# Altium project Capstone_SDR_PLUTOV2.PrjPcb (part 3 of 3)

## Sheet POWERMANAGE.SchDoc
size A3; SheetNumber: 10; SheetTotal: 14; SPICEModelCacheCHAYJENF: <root> / <DocumentId>CHAYJENF</DocumentId> / <CacheFrame Number="0"> / <Model Name="emk105bj105_v-f" Kind="CKT"> / <Text>* EMK105BJ105_V-F     SPICE MODEL  ( General Type ) / *-------------------------------------------------------------------------------------------------------- / * Model Generated by TAIYO YUDEN Corporation (http://www.ty-top.com) / * Version 1.0 / * TAIYO YUDEN Control No. 170508_130520 / * Copyright(c) 2012 TAIYO YUDEN CO.,LTD. All Rights Reserved. / *-------------------------------------------------------------------------------------------------------- / * / * Products Name : Multilayer Ceramic Capacitors / * / * Characteristics : / *     Capacitance : 1 uF , Rated Voltage : 16V , TCC : X5R / *     Case Size : 1.0 x 0.5 / 0.039 x 0.02 [mm/inch] , Thickness : 0.5 / 0.02 [mm/inch] / *     (Conditions: Temperature = 25 degC , DC Bias Current/Voltage = 0A / 0V) / * / * Frequency Range : 40Hz - 3GHz / * / * External Node Assignments : / * / *  1  o---| |---o  2 / * / *-------------------------------------------------------------------------------------------------------- / .SubCkt EMK105BJ105_V-F 1 2 / **************************** / C0 1 110 0.68309u / Cm 1 101 0.26053u / C1 101 102 0.94076u / Rc1 101 102 1.9029k / C2 102 103 0.66707u / Rc2 102 103 120.36 / C3 103 110 0.57203u / Rc3 103 110 2.1097 / C2m 1 301 0.1871u / C21 301 302 3.2494u / Rc21 301 302 1.1117k / C22 302 303 2.1014u / Rc22 302 303 1.484k / C23 303 304 2.1172u / Rc23 303 304 1.3876k / C24 304 305 0.75729u / Rc24 304 305 332.59 / C25 305 306 0.94401u / Rc25 305 306 249.09 / C26 306 307 0.34674u / Rc26 306 307 28.352 / C27 307 308 0.37158u / Rc27 307 308 19.989 / C28 308 309 0.17933u / Rc28 308 309 31.748 / C29 309 110 0.016445u / Rc29 309 110 1.0592 / Rp0 1 110 100Meg / L0 110 120 0.2216n / Lm 120 130 0.1509n / L1 120 121 0.12659n / RL1 121 130 0.85161 / L2 120 122 0.15996n / RL2 122 130 0.42469 / L3 120 123 7.9543n / RL3 123 130 0.54643m / CR 120 124 0.24334u / LR 124 125 0.090738n / RR 125 130 68.076m / CL 130 140 2.7354p / LL 130 140 0.10762n / RL 130 140 50.614 / Rs 140 2 7.5416m / **************************** / .ends EMK105BJ105_V-F</Text> / </Model> / </CacheFrame> / </root>
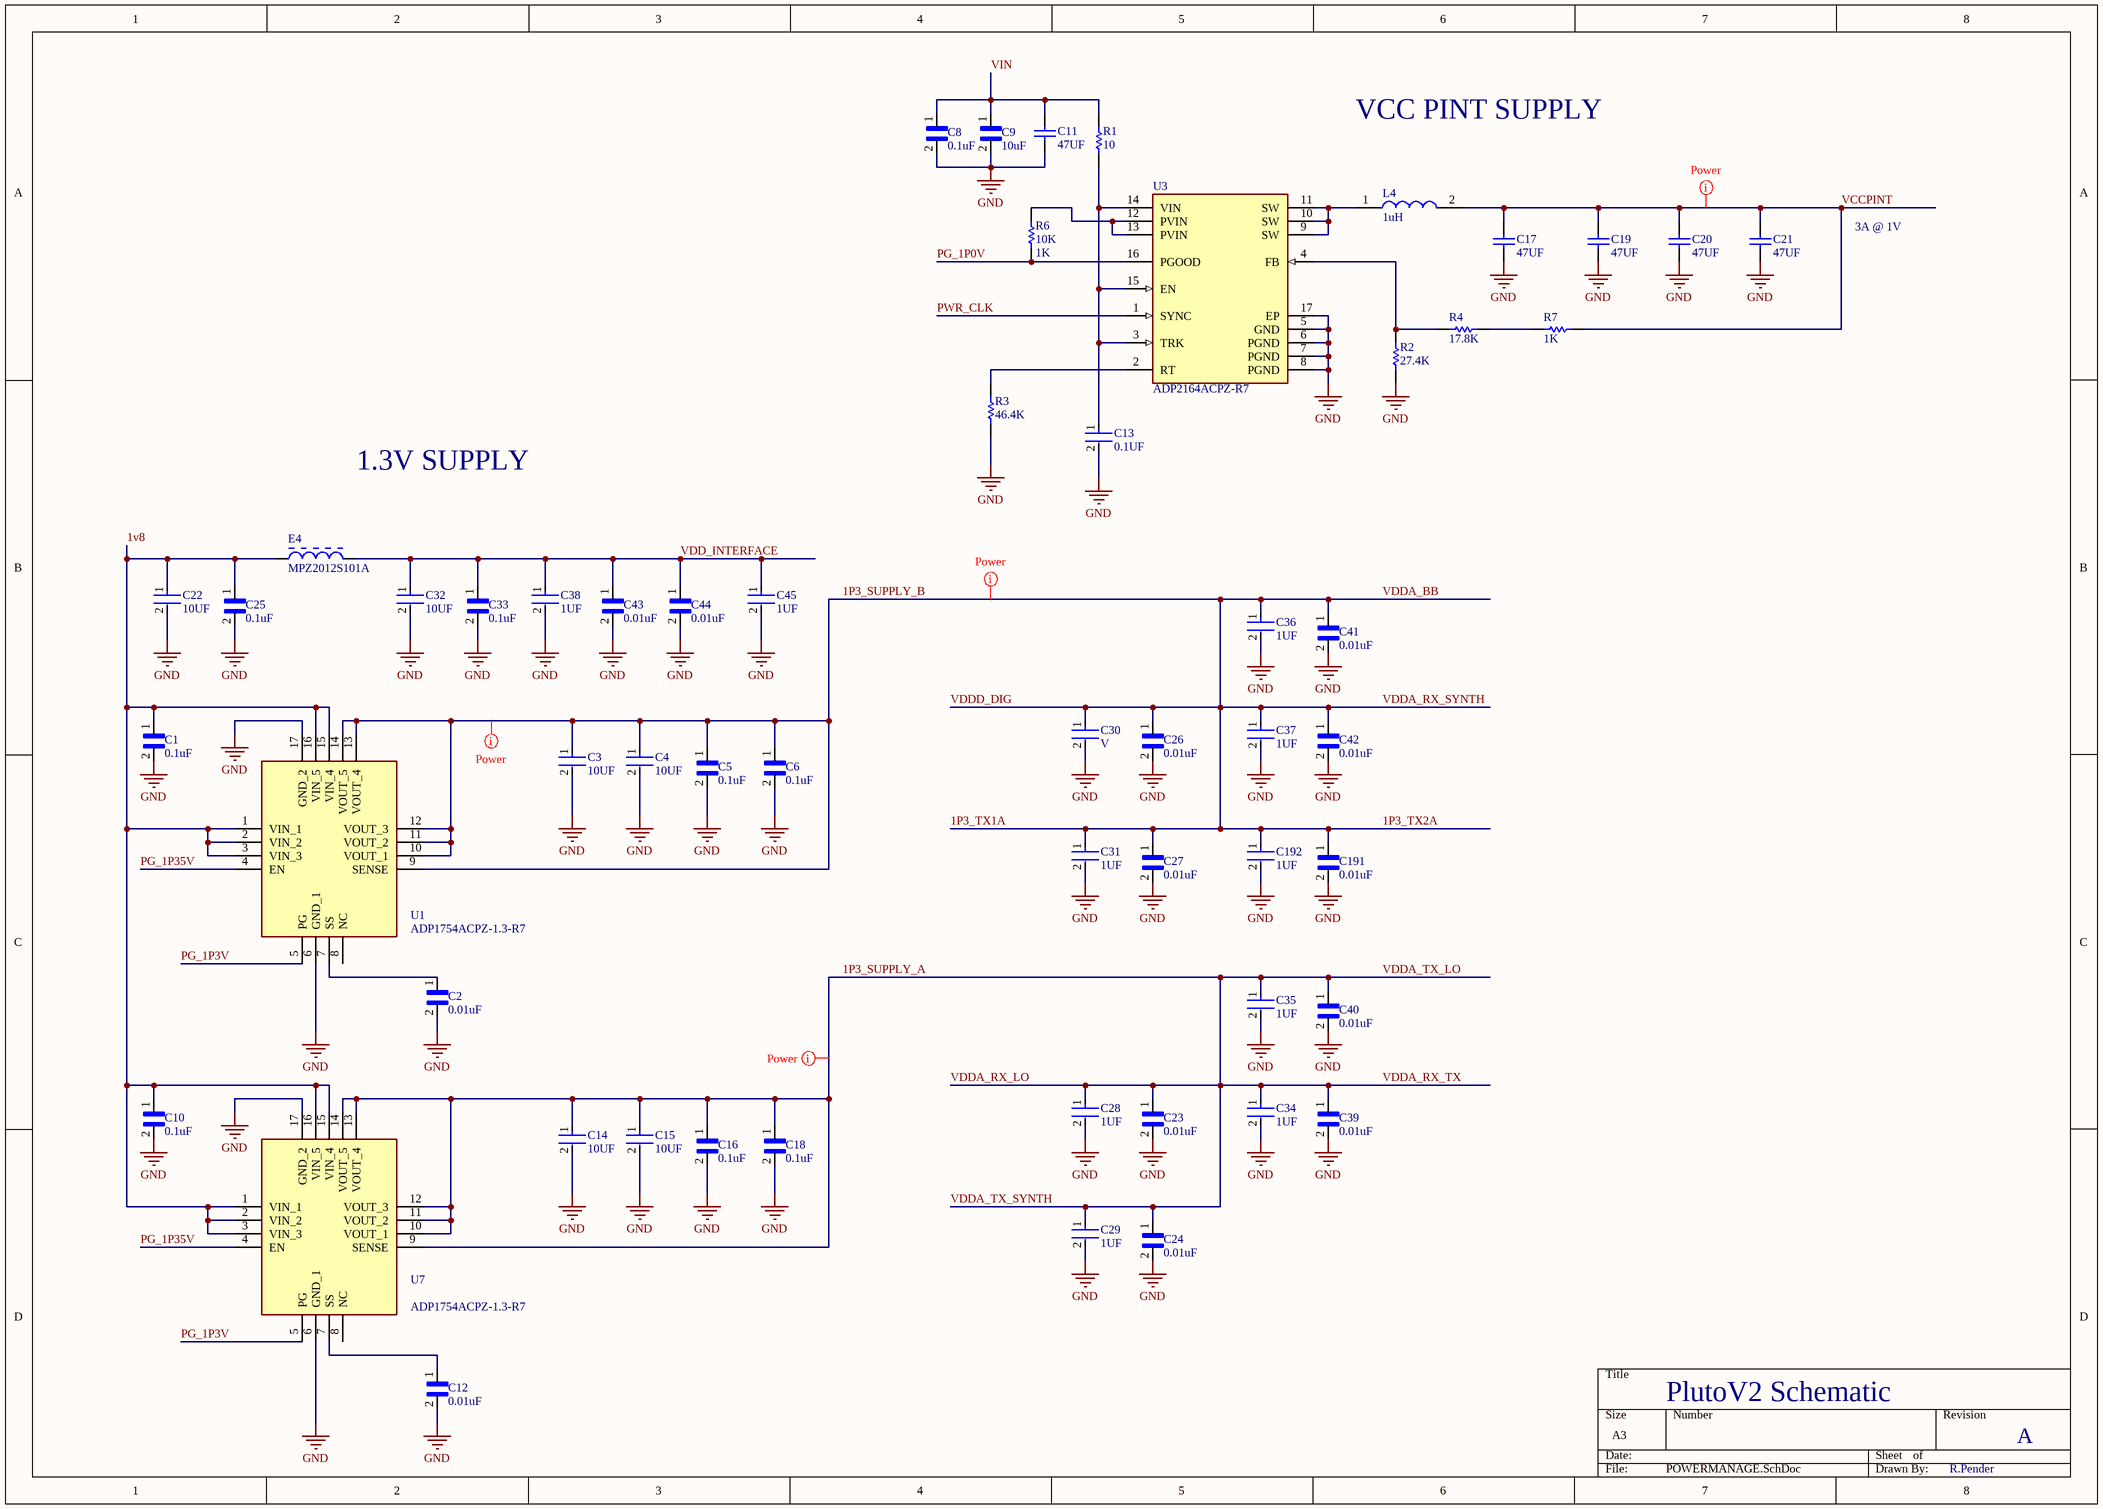
[diagram p9: POWERMANAGE.SchDoc]

### Parts
C1  0.1uF  [CAPC0603X33N]
C2  0.01uF  [CAPC0603X33N]
C3  10UF  [FP-GRM188-0_1-e0_2_0_55-IPC_A]
C4  10UF  [FP-GRM188-0_1-e0_2_0_55-IPC_A]
C5  0.1uF  [CAPC0603X33N]
C6  0.1uF  [CAPC0603X33N]
C8  0.1uF  [CAPC0603X33N]
C9  10uF  [CAPC0603X33N]
C10  0.1uF  [CAPC0603X33N]
C11  47UF  [TAYO-JMK212BBJ476MG-T_L]
C12  0.01uF  [CAPC0603X33N]
C13  0.1UF  [FP-GRM188-0_15-MFG]
C14  10UF  [FP-GRM188-0_1-e0_2_0_55-IPC_A]
C15  10UF  [FP-GRM188-0_1-e0_2_0_55-IPC_A]
C16  0.1uF  [CAPC0603X33N]
C17  47UF  [TAYO-JMK212BBJ476MG-T_L]
C18  0.1uF  [CAPC0603X33N]
C19  47UF  [TAYO-JMK212BBJ476MG-T_L]
C20  47UF  [TAYO-JMK212BBJ476MG-T_L]
C21  47UF  [TAYO-JMK212BBJ476MG-T_L]
C22  10UF  [FP-GRM188-0_1-e0_2_0_55-IPC_A]
C23  0.01uF  [CAPC0603X33N]
C24  0.01uF  [CAPC0603X33N]
C25  0.1uF  [CAPC0603X33N]
C26  0.01uF  [CAPC0603X33N]
C27  0.01uF  [CAPC0603X33N]
C28  1UF  [FP-0402-L_1_0_0_05-W_0_5-IPC_A]
C29  1UF  [FP-0402-L_1_0_0_05-W_0_5-IPC_A]
C30  V  [FP-0402-L_1_0_0_05-W_0_5-IPC_A]
C31  1UF  [FP-0402-L_1_0_0_05-W_0_5-IPC_A]
C32  10UF  [FP-GRM188-0_1-e0_2_0_55-IPC_A]
C33  0.1uF  [CAPC0603X33N]
C34  1UF  [FP-0402-L_1_0_0_05-W_0_5-IPC_A]
C35  1UF  [FP-0402-L_1_0_0_05-W_0_5-IPC_A]
C36  1UF  [FP-0402-L_1_0_0_05-W_0_5-IPC_A]
C37  1UF  [FP-0402-L_1_0_0_05-W_0_5-IPC_A]
C38  1UF  [FP-0402-L_1_0_0_05-W_0_5-IPC_A]
C39  0.01uF  [CAPC0603X33N]
C40  0.01uF  [CAPC0603X33N]
C41  0.01uF  [CAPC0603X33N]
C42  0.01uF  [CAPC0603X33N]
C43  0.01uF  [CAPC0603X33N]
C44  0.01uF  [CAPC0603X33N]
C45  1UF  [FP-0402-L_1_0_0_05-W_0_5-IPC_A]
C191  0.01uF  [CAPC0603X33N]
C192  1UF  [FP-0402-L_1_0_0_05-W_0_5-IPC_A]
E4  MPZ2012S101A  [TDK-MPZ2012S101A-2_V]
L4  1uH  [XFL4020102MEB]
R1  10  [RESC0603X26X15LL03T05]
R2  27.4K  [2-0402]
R3  46.4K  [1-0201]
R4  17.8K  [2-0402]
R6  10K  value 1K  [AXIAL-0.3]
R7  1K  [2-0402]
U1  ADP1754ACPZ-1.3-R7  [QFN65P400X400X80-17N-D]
U3  ADP2164ACPZ-R7  [FP-CP-16-26-IPC_C]
U7  ADP1754ACPZ-1.3-R7  [QFN65P400X400X80-17N-D]

### Nets
GND: C1.2 C2.2 C3.2 C4.2 C5.2 C6.2 C8.2 C9.2 C10.2 C11.2 C12.2 C13.2 C14.2 C15.2 C16.2 C17.2 C18.2 C19.2 C20.2 C21.2 C22.2 C23.2 C24.2 C25.2 C26.2 C27.2 C28.2 C29.2 C30.2 C31.2 C32.2 C33.2 C34.2 C35.2 C36.2 C37.2 C38.2 C39.2 C40.2 C41.2 C42.2 C43.2 C44.2 C45.2 C191.2 C192.2 R2.2 R3.2 U1.6(GND_1) U1.17(GND_2) U3.5(GND) U3.6(PGND) U3.7(PGND) U3.8(PGND) U3.17(EP) U7.6(GND_1) U7.17(GND_2)
1P3_SUPPLY_A: C14.1 C15.1 C16.1 C18.1 C23.1 C24.1 C28.1 C29.1 C34.1 C35.1 C39.1 C40.1 U7.9(SENSE) U7.10(VOUT_1) U7.11(VOUT_2) U7.12(VOUT_3) U7.13(VOUT_4) U7.14(VOUT_5)  [also labelled VDDA_RX_LO, VDDA_RX_TX, VDDA_TX_LO, VDDA_TX_SYNTH]
1P3_SUPPLY_B: C3.1 C4.1 C5.1 C6.1 C26.1 C27.1 C30.1 C31.1 C36.1 C37.1 C41.1 C42.1 C191.1 C192.1 U1.9(SENSE) U1.10(VOUT_1) U1.11(VOUT_2) U1.12(VOUT_3) U1.13(VOUT_4) U1.14(VOUT_5)  [also labelled 1P3_TX1A, 1P3_TX2A, VDDA_BB, VDDA_RX_SYNTH, VDDD_DIG]
1v8: C1.1 C10.1 C22.1 C25.1 E4.1 U1.1(VIN_1) U1.2(VIN_2) U1.3(VIN_3) U1.15(VIN_4) U1.16(VIN_5) U7.1(VIN_1) U7.2(VIN_2) U7.3(VIN_3) U7.15(VIN_4) U7.16(VIN_5)
PG_1P0V: R6.1 U3.16(PGOOD)
PG_1P3V: U1.5(PG) U7.5(PG)
PG_1P35V: U1.4(EN) U7.4(EN)
PWR_CLK: U3.1(SYNC)
VCCPINT: C17.1 C19.1 C20.1 C21.1 L4.2 R7.2
VDD_INTERFACE: C32.1 C33.1 C38.1 C43.1 C44.1 C45.1 E4.2
VIN: C8.1 C9.1 C11.1 R1.2
NetC2_1: C2.1 U1.7(SS)
NetC12_1: C12.1 U7.7(SS)
NetC13_1: C13.1 R1.1 U3.3(TRK) U3.14(VIN) U3.15(EN)
NetL4_1: L4.1 U3.9(SW) U3.10(SW) U3.11(SW)
NetR2_1: R2.1 R4.1 U3.4(FB)
NetR3_1: R3.1 U3.2(RT)
NetR4_2: R4.2 R7.1
NetR6_2: R6.2 U3.12(PVIN) U3.13(PVIN)

Not connected (* = marked no-connect by the designer): U1 8(NC); U7 8(NC)

### Layout directives
net class Power: 1P3_SUPPLY_A, 1P3_SUPPLY_B, VCCPINT

### Notes on the sheet
- VCC PINT SUPPLY
- 3A @ 1V
- 1.3V SUPPLY
- PlutoV2 Schematic
- A
- R.Pender

### Library data of the parts
C1 C5 C6 C8 C10 C16 C18 C25 C33 = GRM033R61C104ME84D: CAP 0.1UF 16VDC X5R 20% SMD 0201 PAPER TAPE; Package: None; Price: None; Value: *; MP: GRM033R61C104ME84D; Availability: Unavailable
C2 C9 C12 C23 C24 C26 C27 C39-C44 C191 = GRM033R71A103KA01D: SMD Capacitor X7R(EIA) with Capacitance: 10000pF Tol. 10%. Rated Voltage: 10Vdc; MF: Murata; Package: 0603 Taiyo Yuden; MP: GRM033R71A103KA01D; Value: *; SnapEDA_Link: https://www.snapeda.com/parts/GRM033R71A103KA01D/Murata/view-part/4379446/?ref=snap; Availability: Unavailable; Price: None; Check_prices: https://www.snapeda.com/parts/GRM033R71A103KA01D/Murata/view-part/4379446/?ref=eda
C3 C4 C14 C15 C22 C32 = CMP-2006-02792-2: Chip Multilayer Ceramic Capacitors for General Purpose, 0603, 10uF, X5R, 15%, 20%, 6.3V; Packaging: Tape and Reel; Voltage Rating (DC): 6.3V; Width: 0.031inch; Termination: SMD/SMT; Dielectric: X5R; Package Quantity: 4000; Voltage Rating: 6.3V; Capacitance: 10uF; Case/Package: 0603; Min Operating Temperature: -55°C; Voltage: 6.3V; Length: 1.6mm; Thickness: 0.035inch; Lead Free: Lead Free; Depth: 0.8mm; Case Code (Imperial): 0603; Max Operating Temperature: 85°C; Material: Ceramic; Height: 0.8mm; Tolerance: 20%; Mount: Surface Mount; REACH SVHC: No SVHC; Radiation Hardening: No; Case Code (Metric): 1608
C11 C17 C19-C21 = CMP-2000-06498-1: High Value Multilayer Ceramic Capacitor, 47 uF, +/-20%, 6.3 V, -55 to 85 degC, 2-Pin SMD (0805), RoHS, Tape and Reel; Manufacturer: Taiyo Yuden; PCN Part Number: X5R,X7RDielectrics23/Jan/2008; Kits: 587-1797-KIT-ND-KITCAPCERHICAP0603&0805S; Temperature Coefficient: X5R; Tolerance: ±20%; Online Catalog: MSeries; Other Names: 587-1779-1; Capacitance: 47µF; Voltage - Rated: 6.3V; Catalog Drawings: xMKSeries_0805_1.25; Operating Temperature: -55°C~85°C; Mounting Technology: SurfaceMount; Package Reference: 0805; Features: -; Lead Spacing: -; Lead Style: -; Family: CeramicCapacitors; Size / Dimension: 0.079"Lx0.049"W(2.00mmx1.25mm); Package Description: 2-Pin SMD, Body 2.2 x 1.45 mm; Mounting Type: SurfaceMount,MLCC; Package / Case: 0805(2012Metric); Series: M; Category: Capacitors; Packaging: CutTape(CT); Datasheet Version: 10/2015; Datasheet URL: http://datasheet.octopart.com/JMK212BJ476MG-T-Taiyo-Yuden-datasheet-62109412.pdf; Manufacturer URL: http://www.t-yuden.com/; Ratings: -; Height - Seated (Max): -; Standard Package: 1; Thickness (Max): 0.053"(1.35mm); Applications: GeneralPurpose
C13 = CMP-06035-003612-1: as C135-C138 on sheet POWERREG; Tolerance: 20%; Dielectric: X5R; Package Quantity: 4000; Width: 0.8mm; Case/Package: 0603; Thickness: 0.035inch; Capacitance: 10uF; Voltage Rating: 10V; Voltage Rating (DC): 10V; Termination: SMD/SMT; Length: 1.6mm; Lead Free: Lead Free; Mount: Surface Mount; Height: 0.8mm; Depth: 0.8mm; Packaging: Tape and Reel; Weight: 0.000222oz; Min Operating Temperature: -55°C; Case Code (Metric): 1608; Max Operating Temperature: 85°C; Case Code (Imperial): 0603; Material: Ceramic
C28 C29 C31 C34-C38 C45 C192 = CMP-14477-000104-2: as C141 on sheet POWERREG; Packaging: Tape and Reel; Depth: 0.5mm; Mount: Surface Mount; Thickness: 0.022inch; Package Quantity: 1; Min Operating Temperature: -55°C; Series: M; Voltage Rating (DC): 16V; Termination: SMD/SMT; Case/Package: 0402; Number of Pins: 2; Case Code (Imperial): 0402; Capacitance: 1uF; Length: 1mm; Halogen Free: Halogen Free; Case Code (Metric): 1005; Width: 0.02inch; RoHS Compliant: Yes; Radiation Hardening: No; Max Operating Temperature: 85°C; Height: 0.5mm; Construction: Flat
C30 = CMP-14477-000104-2: None; Tolerance: 10%; Voltage Rating: 16V; Dielectric: X5R; Capacitance: 1uF; Packaging: Tape and Reel; Depth: 0.5mm; Mount: Surface Mount; Thickness: 0.022inch; Package Quantity: 1; Min Operating Temperature: -55°C; Series: M; Voltage Rating (DC): 16V; Termination: SMD/SMT; Case/Package: 0402; Number of Pins: 2; Case Code (Imperial): 0402; Length: 1mm; Halogen Free: Halogen Free; Case Code (Metric): 1005; Width: 0.02inch; RoHS Compliant: Yes; Radiation Hardening: No; Max Operating Temperature: 85°C; Height: 0.5mm; Construction: Flat
E4 = CMP-2000-05399-1: Chip Bead for Power Line, 100 Ohm, +/- 25%, 4 A, -55 to 125 degC, 0805 (2012 Metric), RoHS, Tape and Reel; Manufacturer: TDK; Maximum DC Resistance: 20mOhms; Test Frequency: 100MHz; Impedance: 100Ohms; Case Width: 1.25mm; Case Length: 2mm; Maximum DC Current: 4A; Case Height: 0.85mm; Package Reference: MPZ2012S101A-2; RoHS: Details; Tolerance: 25%; Operating Temperature Range: -55Cto+125C; Datasheet Version: Jul-13; Dimensions: 1.25mmWx2mmLx0.85mmH; Product: FerriteChipBeads; Termination Style: SMD/SMT; Datasheet URL: http://www.farnell.com/datasheets/1750041.pdf; Factory Pack Quantity: 4000; Brand: TDK; Packaging: Reel; Package Description: 2-Pin Surface Mount Device, Body 2 x 1.25 mm; Product Category: EMIFilterBeads,Chips&Arrays; Manufacturer URL: http://www.tdk.com/; Package / Case: 0805(2012metric)
L4 = XFL4020-102MEB: Inductor; Manufacturer_Name: COILCRAFT; Datasheet Link: https://www.coilcraft.com/getmedia/50632d43-da1b-4cdb-8ab4-3029cab51df3/xfl4020.pdf; Height: 2.1mm; Manufacturer_Part_Number: XFL4020-102MEB
R1 = CMP-2004-03448-1: Manufacturer: Panasonic; Part Number: ERJ1GNF10R0C
R2 R4 R7 = ERJ2RK: Precision Thick Film Chip Resistor, 10 Ohm to 1M Ohm Range, 1% and 0.5% Tolerance, 0402 Size, 0.063 W; Published: 17-Dec-2003; LatestRevisionDate: 19-Mar-2004; LatestRevisionNote: Silkscreen size reduced.; PackageDocument: Mar-2003; PackageReference: 2-0402; Publisher: Altium Limited; Code_IPC: 1005 [0402]; ComponentLink1Description: Manufacturer Link; ComponentLink1URL: http://www.panasonic.com/industrial/components/resistive_products.htm; ComponentLink2Description: Datasheet; ComponentLink2URL: http://www.panasonic.com/industrial/components/pdf/AOA0000CE2.pdf
R3 = ERJ1GE: Thick Film Chip Resistor, 10 Ohm to 1M Ohm Range, 5% Tolerance, 0201 Size, 0.05 W; Note: If flow soldering, adjust pad width of PCB Footprint to 0.7 - 0.8 times the width of the resistor.; Published: 17-Dec-2003; LatestRevisionDate: 19-Mar-2004; LatestRevisionNote: Silkscreen size reduced.; PackageDocument: Mar-2003; PackageReference: 1-0201; Publisher: Altium Limited; ComponentLink1Description: Manufacturer Link; ComponentLink1URL: http://www.panasonic.com/industrial/components/resistive_products.htm; ComponentLink2Description: Datasheet; ComponentLink2URL: http://www.panasonic.com/industrial/components/pdf/AOA0000CE1.pdf
R6 = Res1: Resistor; Published: 8-Jun-2000; LatestRevisionDate: 17-Jul-2002; LatestRevisionNote: Re-released for DXP Platform.; PackageReference: AXIAL-0.3; Publisher: Altium Limited; PackageDescription: Axial Device, Thru-Hole; 2 Leads; 0.3 in Pin Spacing
U1 U7 = ADP1754ACPZ-1.3-R7: Integrated Circuit; Manufacturer_Name: Analog Devices; Datasheet Link: https://www.analog.com/media/en/technical-documentation/data-sheets/ADP1754_1755.pdf; Height: 0.8mm; Manufacturer_Part_Number: ADP1754ACPZ-1.3-R7
U3 = CMP-09139-000017-1: IC REG BUCK ADJ 4A 16LFCSP; Manufacturer: Analog Devices; Standoff Height: 0.02mm; Max Junction Temp: +125°C; Max Duty Cycle: 100%; Output Type: AdjustableProgrammable; Switching Frequency: 500-1400kHz; Min Supply Voltage: 2.7V; Max Supply Voltage: 6.5V; Nominal Supply Current: 895uA; Number Of Outputs: 1; Output Voltage: 0.6-6.5V; Switching Topology: Buck; Mouser Description: Dc-Dc Switching Buck Step Down Regulator, Adjustable, 2.7V-6.5Vin, 600Mv-6.5Vout, 4Aout, Lfcsp-16 Rohs Compliant: Yes; Automotive: No; Height: 0.8mm; Temperature Range Low: -40°C; ComponentLink2Description: Datasheet; Octopart: https://octopart.com/adp2164acpz-r7-analog+devices-21054168; Lead Free: Yes; ComponentLink2URL: https://www.analog.com/media/en/technical-documentation/data-sheets/ADP2164.PDF; Category: IC; Output Current: 4A; RoHS: TRUE; Ipc Land Pattern Name: QFN65P400X400X75-16; Device Class L2: Power Management ICs; Package: CP-16-26; Temperature Range High: +125°C; Device Class L1: Integrated Circuits (ICs); Manufacturer Part Number: ADP2164ACPZ-R7; Digikey Description: IC REG BUCK ADJ 4A 16LFCSP; Device Class L3: Voltage Regulators - Switching; Temperature: -40°C to +125°C

## Sheet POWERMANAGE2.SchDoc
size A3; SheetNumber: 11; SheetTotal: 14; SPICEModelCacheVRZJBZTH: <root> / <DocumentId>VRZJBZTH</DocumentId> / </root>
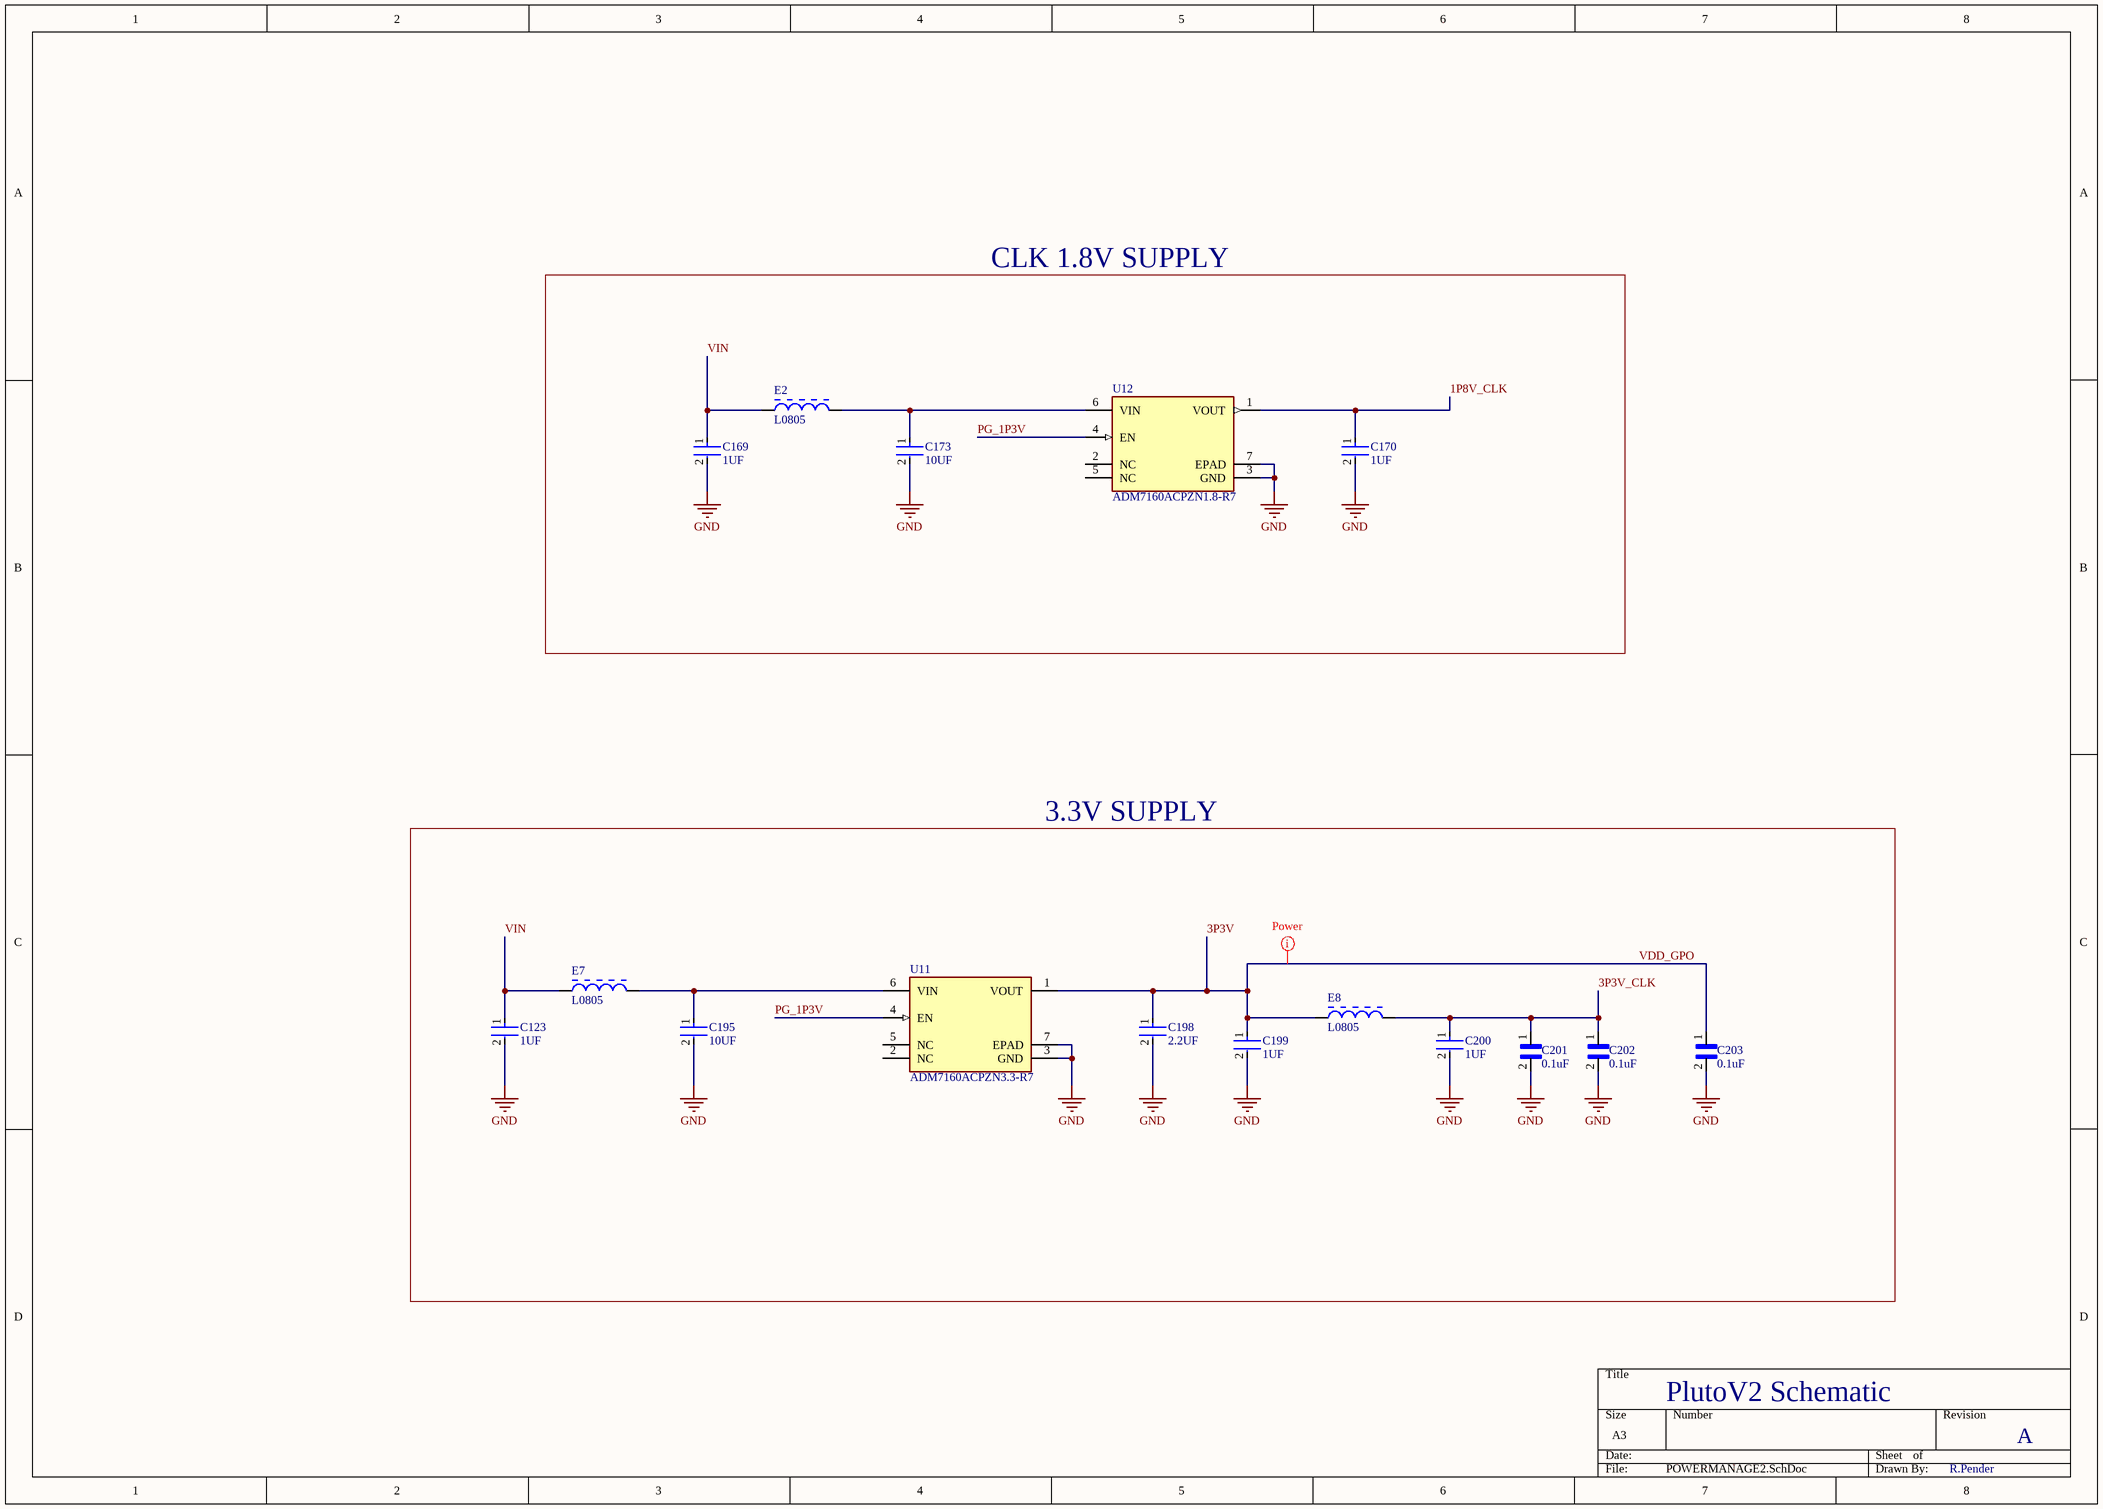
[diagram p10: POWERMANAGE2.SchDoc]

### Parts
C123  1UF  [FP-0402-L_1_0_0_05-W_0_5-IPC_A]
C169  1UF  [FP-0402-L_1_0_0_05-W_0_5-IPC_A]
C170  1UF  [FP-0402-L_1_0_0_05-W_0_5-IPC_A]
C173  10UF  [FP-GRM188-0_15-MFG]
C195  10UF  [FP-GRM188-0_15-MFG]
C198  2.2UF  [FP-GRM188-0_2-IPC_C]
C199  1UF  [FP-0402-L_1_0_0_05-W_0_5-IPC_A]
C200  1UF  [FP-0402-L_1_0_0_05-W_0_5-IPC_A]
C201  0.1uF  [CAPC0603X33N]
C202  0.1uF  [CAPC0603X33N]
C203  0.1uF  [CAPC0603X33N]
E2  L0805  [TDK-MPZ2012S101A-2_V]
E7  L0805  [TDK-MPZ2012S101A-2_V]
E8  L0805  [TDK-MPZ2012S101A-2_V]
U11  ADM7160ACPZN3.3-R7  [FP-CP-6-3-IPC_A]
U12  ADM7160ACPZN1.8-R7  [FP-CP-6-3-IPC_C]

### Blocks framed on the sheet
CLK 1.8V SUPPLY: C169 C170 C173 E2 U12
3.3V SUPPLY: C123 C195 C198-C203 E7 E8 U11

### Nets
GND: C123.2 C169.2 C170.2 C173.2 C195.2 C198.2 C199.2 C200.2 C201.2 C202.2 C203.2 U11.3(GND) U11.7(EPAD) U12.3(GND) U12.7(EPAD)
1P8V_CLK: C170.1 U12.1(VOUT)
3P3V: C198.1 C199.1 C203.1 E8.1 U11.1(VOUT)  [also labelled VDD_GPO]
3P3V_CLK: C200.1 C201.1 C202.1 E8.2
PG_1P3V: U11.4(EN) U12.4(EN)
VIN: C123.1 C169.1 E2.1 E7.1
NetC173_1: C173.1 E2.2 U12.6(VIN)
NetC195_1: C195.1 E7.2 U11.6(VIN)

Not connected (* = marked no-connect by the designer): U11 2(NC) 5(NC); U12 2(NC) 5(NC)

### Layout directives
net class Power: 3P3V

### Notes on the sheet
- PlutoV2 Schematic
- A
- R.Pender

### Library data of the parts
C123 C169 C170 C199 C200 = CMP-14477-000104-2: as C141 on sheet POWERREG; Packaging: Tape and Reel; Depth: 0.5mm; Mount: Surface Mount; Thickness: 0.022inch; Package Quantity: 1; Min Operating Temperature: -55°C; Series: M; Voltage Rating (DC): 16V; Termination: SMD/SMT; Case/Package: 0402; Number of Pins: 2; Case Code (Imperial): 0402; Capacitance: 1uF; Length: 1mm; Halogen Free: Halogen Free; Case Code (Metric): 1005; Width: 0.02inch; RoHS Compliant: Yes; Radiation Hardening: No; Max Operating Temperature: 85°C; Height: 0.5mm; Construction: Flat
C173 C195 = CMP-06035-003612-1: as C135-C138 on sheet POWERREG; Tolerance: 20%; Dielectric: X5R; Package Quantity: 4000; Width: 0.8mm; Case/Package: 0603; Thickness: 0.035inch; Capacitance: 10uF; Voltage Rating: 10V; Voltage Rating (DC): 10V; Termination: SMD/SMT; Length: 1.6mm; Lead Free: Lead Free; Mount: Surface Mount; Height: 0.8mm; Depth: 0.8mm; Packaging: Tape and Reel; Weight: 0.000222oz; Min Operating Temperature: -55°C; Case Code (Metric): 1608; Max Operating Temperature: 85°C; Case Code (Imperial): 0603; Material: Ceramic
C198 = CMP-06035-023692-1: Chip Multilayer Ceramic Capacitors for General Purpose, 0603, 2.2uF, X5R, 15%, 10%, 50V; Mount: Surface Mount; Case/Package: 0603; Voltage Rating (DC): 50V; Weight: 0.000222oz; Capacitance: 2.2uF; Max Operating Temperature: 85°C; Length: 0.063inch; Thickness: 0.039inch; Dielectric: X5R; Min Operating Temperature: -55°C; Termination: SMD/SMT; Resistor Type: Ceramic; Width: 0.8mm; Voltage Rating: 50V; Height: 0.8mm; Tolerance: 10%; Case Code (Metric): 1608; Package Quantity: 10000; Packaging: Tape and Reel; Case Code (Imperial): 0603
C201-C203 = GRM033R61C104ME84D: as C1 on sheet POWERMANAGE; Package: None; Price: None; Value: *; MP: GRM033R61C104ME84D; Availability: Unavailable
E2 E7 E8 = CMP-2000-05399-1: as E4 on sheet POWERMANAGE; Package Reference: MPZ2012S101A-2; RoHS: Details; Tolerance: 25%; Operating Temperature Range: -55Cto+125C; Datasheet Version: Jul-13; Dimensions: 1.25mmWx2mmLx0.85mmH; Product: FerriteChipBeads; Termination Style: SMD/SMT; Datasheet URL: http://www.farnell.com/datasheets/1750041.pdf; Factory Pack Quantity: 4000; Brand: TDK; Packaging: Reel; Package Description: 2-Pin Surface Mount Device, Body 2 x 1.25 mm; Product Category: EMIFilterBeads,Chips&Arrays; Manufacturer URL: http://www.tdk.com/; Package / Case: 0805(2012metric)
U11 = CMP-09138-000129-1: IC REG LINEAR 3.3V 200MA 6LFCSP; Output Type: Fixed; Max Supply Current: 265uA; Max Input Voltage: 5.5V; Number of Regulators: 1; Power Supply Rejection Ratio (PSRR): 49dB; Operating Supply Current: 265mA; Polarity: Positive; Min Input Voltage: 2.2V; Dropout Voltage: 150mV; Accuracy: 1%; Min Current Limit: 220mA; Max Output Current: 200mA; RoHS Compliant: Yes; Case/Package: TSOT; Max Operating Temperature: 125°C; Contact Plating: Gold; Number of Pins: 6; Mount: Surface Mount; Packaging: Tape and Reel; Number of Outputs: 1; Lead Free: Contains Lead; Package Quantity: 3000; Min Operating Temperature: -40°C; Output Voltage: 3.3V; Output Current: 200mA; Quiescent Current: 265uA
U12 = CMP-09138-000112-1: IC REG LINEAR 1.8V 200MA 6LFCSP; Operating Supply Current: 265mA; Power Supply Rejection Ratio (PSRR): 49dB; Polarity: Positive; Max Supply Current: 265uA; Dropout Voltage: 230mV; Number of Outputs: 1; Min Current Limit: 220mA; Output Type: Fixed; Accuracy: 1%; Min Input Voltage: 2.2V; Max Input Voltage: 5.5V; Packaging: Tape and Reel; Case/Package: TSOT; Contact Plating: Gold; Mount: Surface Mount; Max Output Current: 200mA; Min Operating Temperature: -40°C; Output Voltage: 1.8V; Output Current: 200mA; Number of Pins: 6; Package Quantity: 3000; Lead Free: Contains Lead; Quiescent Current: 265uA; Max Operating Temperature: 125°C; Number of Regulators: 1; RoHS Compliant: Yes

## Sheet TESTPOINTS.SchDoc
size A3; SheetNumber: 12; SheetTotal: 14
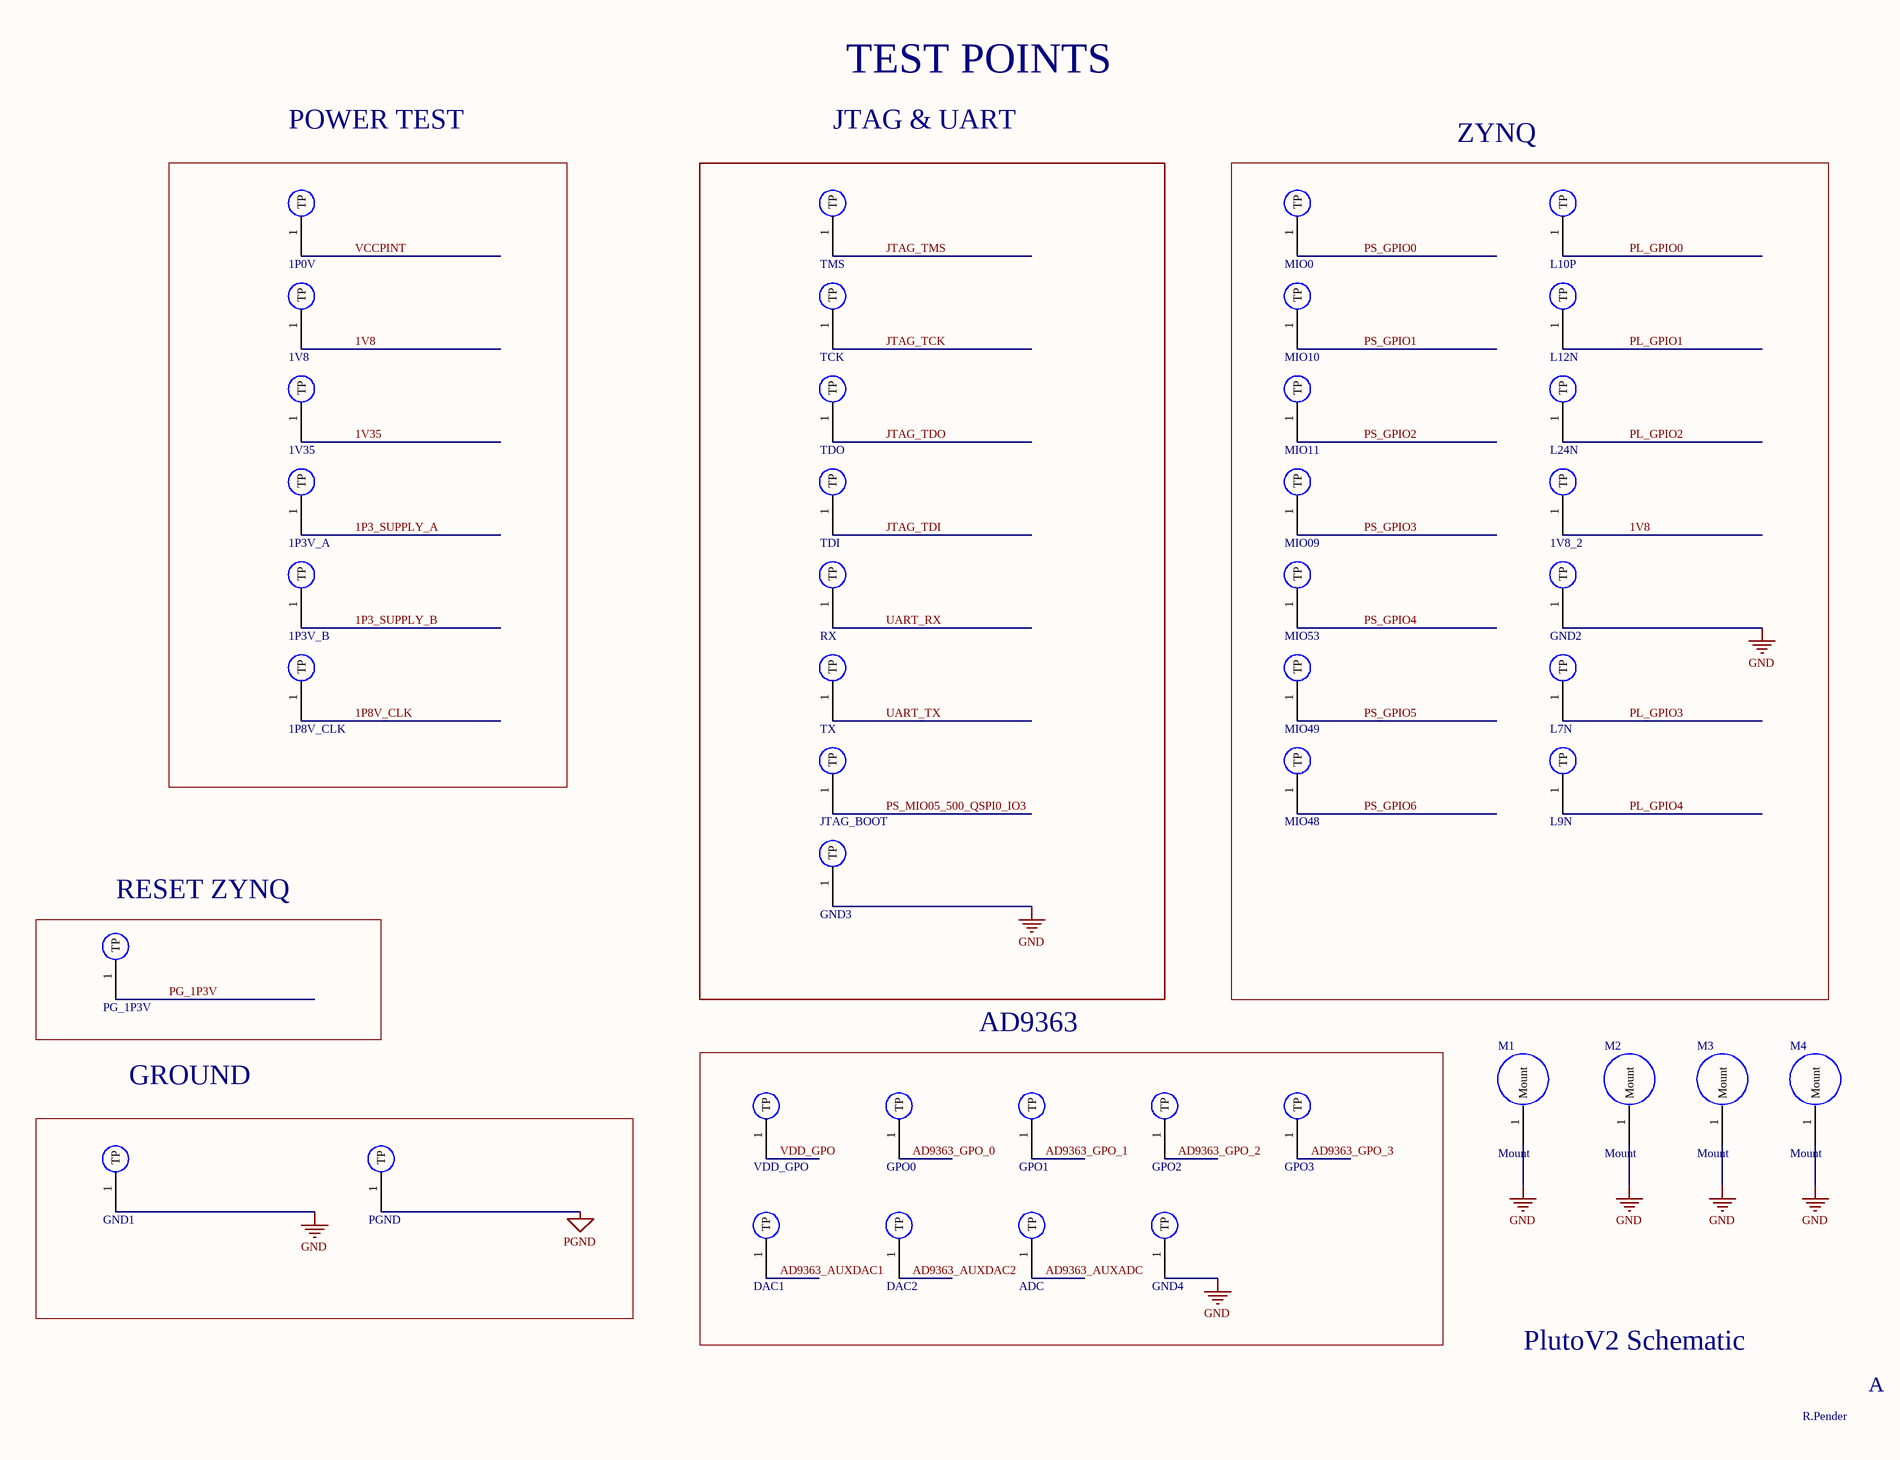
[diagram p11: TESTPOINTS.SchDoc, left]
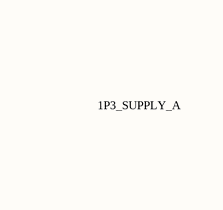
[diagram p12: TESTPOINTS.SchDoc, right]

### Parts
1P0V  TEST POINT  [TESTPOINT1]  (value not drawn)  (no BOM)
1P3V_A  TEST POINT  [TESTPOINT1]  (value not drawn)  (no BOM)
1P3V_B  TEST POINT  [TESTPOINT1]  (value not drawn)  (no BOM)
1P8V_CLK  TEST POINT  [TESTPOINT1]  (value not drawn)  (no BOM)
1V8  TEST POINT  [TESTPOINT1]  (value not drawn)  (no BOM)
1V8_2  TEST POINT  [TESTPOINT1]  (value not drawn)  (no BOM)
1V35  TEST POINT  [TESTPOINT1]  (value not drawn)  (no BOM)
ADC  TEST POINT  [TESTPOINT1]  (value not drawn)  (no BOM)
DAC1  TEST POINT  [TESTPOINT1]  (value not drawn)  (no BOM)
DAC2  TEST POINT  [TESTPOINT1]  (value not drawn)  (no BOM)
GND1  TEST POINT  [TESTPOINT1]  (value not drawn)  (no BOM)
GND2  TEST POINT  [TESTPOINT1]  (value not drawn)  (no BOM)
GND3  TEST POINT  [TESTPOINT1]  (value not drawn)  (no BOM)
GND4  TEST POINT  [TESTPOINT1]  (value not drawn)  (no BOM)
GPO0  TEST POINT  [TESTPOINT1]  (value not drawn)  (no BOM)
GPO1  TEST POINT  [TESTPOINT1]  (value not drawn)  (no BOM)
GPO2  TEST POINT  [TESTPOINT1]  (value not drawn)  (no BOM)
GPO3  TEST POINT  [TESTPOINT1]  (value not drawn)  (no BOM)
JTAG_BOOT  TEST POINT  [TESTPOINT1]  (value not drawn)  (no BOM)
L7N  TEST POINT  [TESTPOINT1]  (value not drawn)  (no BOM)
L9N  TEST POINT  [TESTPOINT1]  (value not drawn)  (no BOM)
L10P  TEST POINT  [TESTPOINT1]  (value not drawn)  (no BOM)
L12N  TEST POINT  [TESTPOINT1]  (value not drawn)  (no BOM)
L24N  TEST POINT  [TESTPOINT1]  (value not drawn)  (no BOM)
M1  Mount  [Mount]
M2  Mount  [Mount]
M3  Mount  [Mount]
M4  Mount  [Mount]
MIO0  TEST POINT  [TESTPOINT1]  (value not drawn)  (no BOM)
MIO09  TEST POINT  [TESTPOINT1]  (value not drawn)  (no BOM)
MIO10  TEST POINT  [TESTPOINT1]  (value not drawn)  (no BOM)
MIO11  TEST POINT  [TESTPOINT1]  (value not drawn)  (no BOM)
MIO48  TEST POINT  [TESTPOINT1]  (value not drawn)  (no BOM)
MIO49  TEST POINT  [TESTPOINT1]  (value not drawn)  (no BOM)
MIO53  TEST POINT  [TESTPOINT1]  (value not drawn)  (no BOM)
PG_1P3V  TEST POINT  [TESTPOINT1]  (value not drawn)  (no BOM)
PGND  TEST POINT  [TESTPOINT1]  (value not drawn)  (no BOM)
RX  TEST POINT  [TESTPOINT1]  (value not drawn)  (no BOM)
TCK  TEST POINT  [TESTPOINT1]  (value not drawn)  (no BOM)
TDI  TEST POINT  [TESTPOINT1]  (value not drawn)  (no BOM)
TDO  TEST POINT  [TESTPOINT1]  (value not drawn)  (no BOM)
TMS  TEST POINT  [TESTPOINT1]  (value not drawn)  (no BOM)
TX  TEST POINT  [TESTPOINT1]  (value not drawn)  (no BOM)
VDD_GPO  TEST POINT  [TESTPOINT1]  (value not drawn)  (no BOM)

### Blocks framed on the sheet
ZYNQ: 1V8_2 GND2 L7N L9N L10P L12N L24N MIO0 MIO09-MIO11 MIO48 MIO49 MIO53
RESET ZYNQ: PG_1P3V
AD9363: ADC DAC1 DAC2 GND4 GPO0-GPO3 VDD_GPO

### Nets
GND: GND1.1(TP) GND2.1(TP) GND3.1(TP) GND4.1(TP) M1.1(Mount) M2.1(Mount) M3.1(Mount) M4.1(Mount)
PGND: PGND.1(TP)
1P3_SUPPLY_A: 1P3V_A.1(TP)
1P3_SUPPLY_B: 1P3V_B.1(TP)
1P8V_CLK: 1P8V_CLK.1(TP)
1v8: 1V8.1(TP) 1V8_2.1(TP)
1v35: 1V35.1(TP)
AD9363_AUXADC: ADC.1(TP)
AD9363_AUXDAC1: DAC1.1(TP)
AD9363_AUXDAC2: DAC2.1(TP)
AD9363_GPO_0: GPO0.1(TP)
AD9363_GPO_1: GPO1.1(TP)
AD9363_GPO_2: GPO2.1(TP)
AD9363_GPO_3: GPO3.1(TP)
JTAG_TCK: TCK.1(TP)
JTAG_TDI: TDI.1(TP)
JTAG_TDO: TDO.1(TP)
JTAG_TMS: TMS.1(TP)
PG_1P3V: PG_1P3V.1(TP)
PL_GPIO0: L10P.1(TP)
PL_GPIO1: L12N.1(TP)
PL_GPIO2: L24N.1(TP)
PL_GPIO3: L7N.1(TP)
PL_GPIO4: L9N.1(TP)
PS_GPIO0: MIO0.1(TP)
PS_GPIO1: MIO10.1(TP)
PS_GPIO2: MIO11.1(TP)
PS_GPIO3: MIO09.1(TP)
PS_GPIO4: MIO53.1(TP)
PS_GPIO5: MIO49.1(TP)
PS_GPIO6: MIO48.1(TP)
PS_MIO05_500_QSPI0_IO3: JTAG_BOOT.1(TP)
UART_RX: RX.1(TP)
UART_TX: TX.1(TP)
VCCPINT: 1P0V.1(TP)
VDD_GPO: VDD_GPO.1(TP)  [project net 3P3V]

### Notes on the sheet
- TEST POINTS
- POWER TEST
- JTAG & UART
- 1P3_SUPPLY_A
- GROUND
- PlutoV2 Schematic
- A
- R.Pender

### Library data of the parts
1P0V 1P3V_A 1P3V_B 1P8V_CLK 1V8 1V8_2 1V35 ADC DAC1 DAC2 GND1-GND4 GPO0-GPO3 JTAG_BOOT L7N L9N L10P L12N L24N MIO0 MIO09-MIO11 MIO48 MIO49 MIO53 PG_1P3V PGND RX TCK TDI TDO TMS TX VDD_GPO = TESTPT

## Sheet AD9363 OSCILLATORS.SchDoc
size A3; SheetNumber: 13; SheetTotal: 14
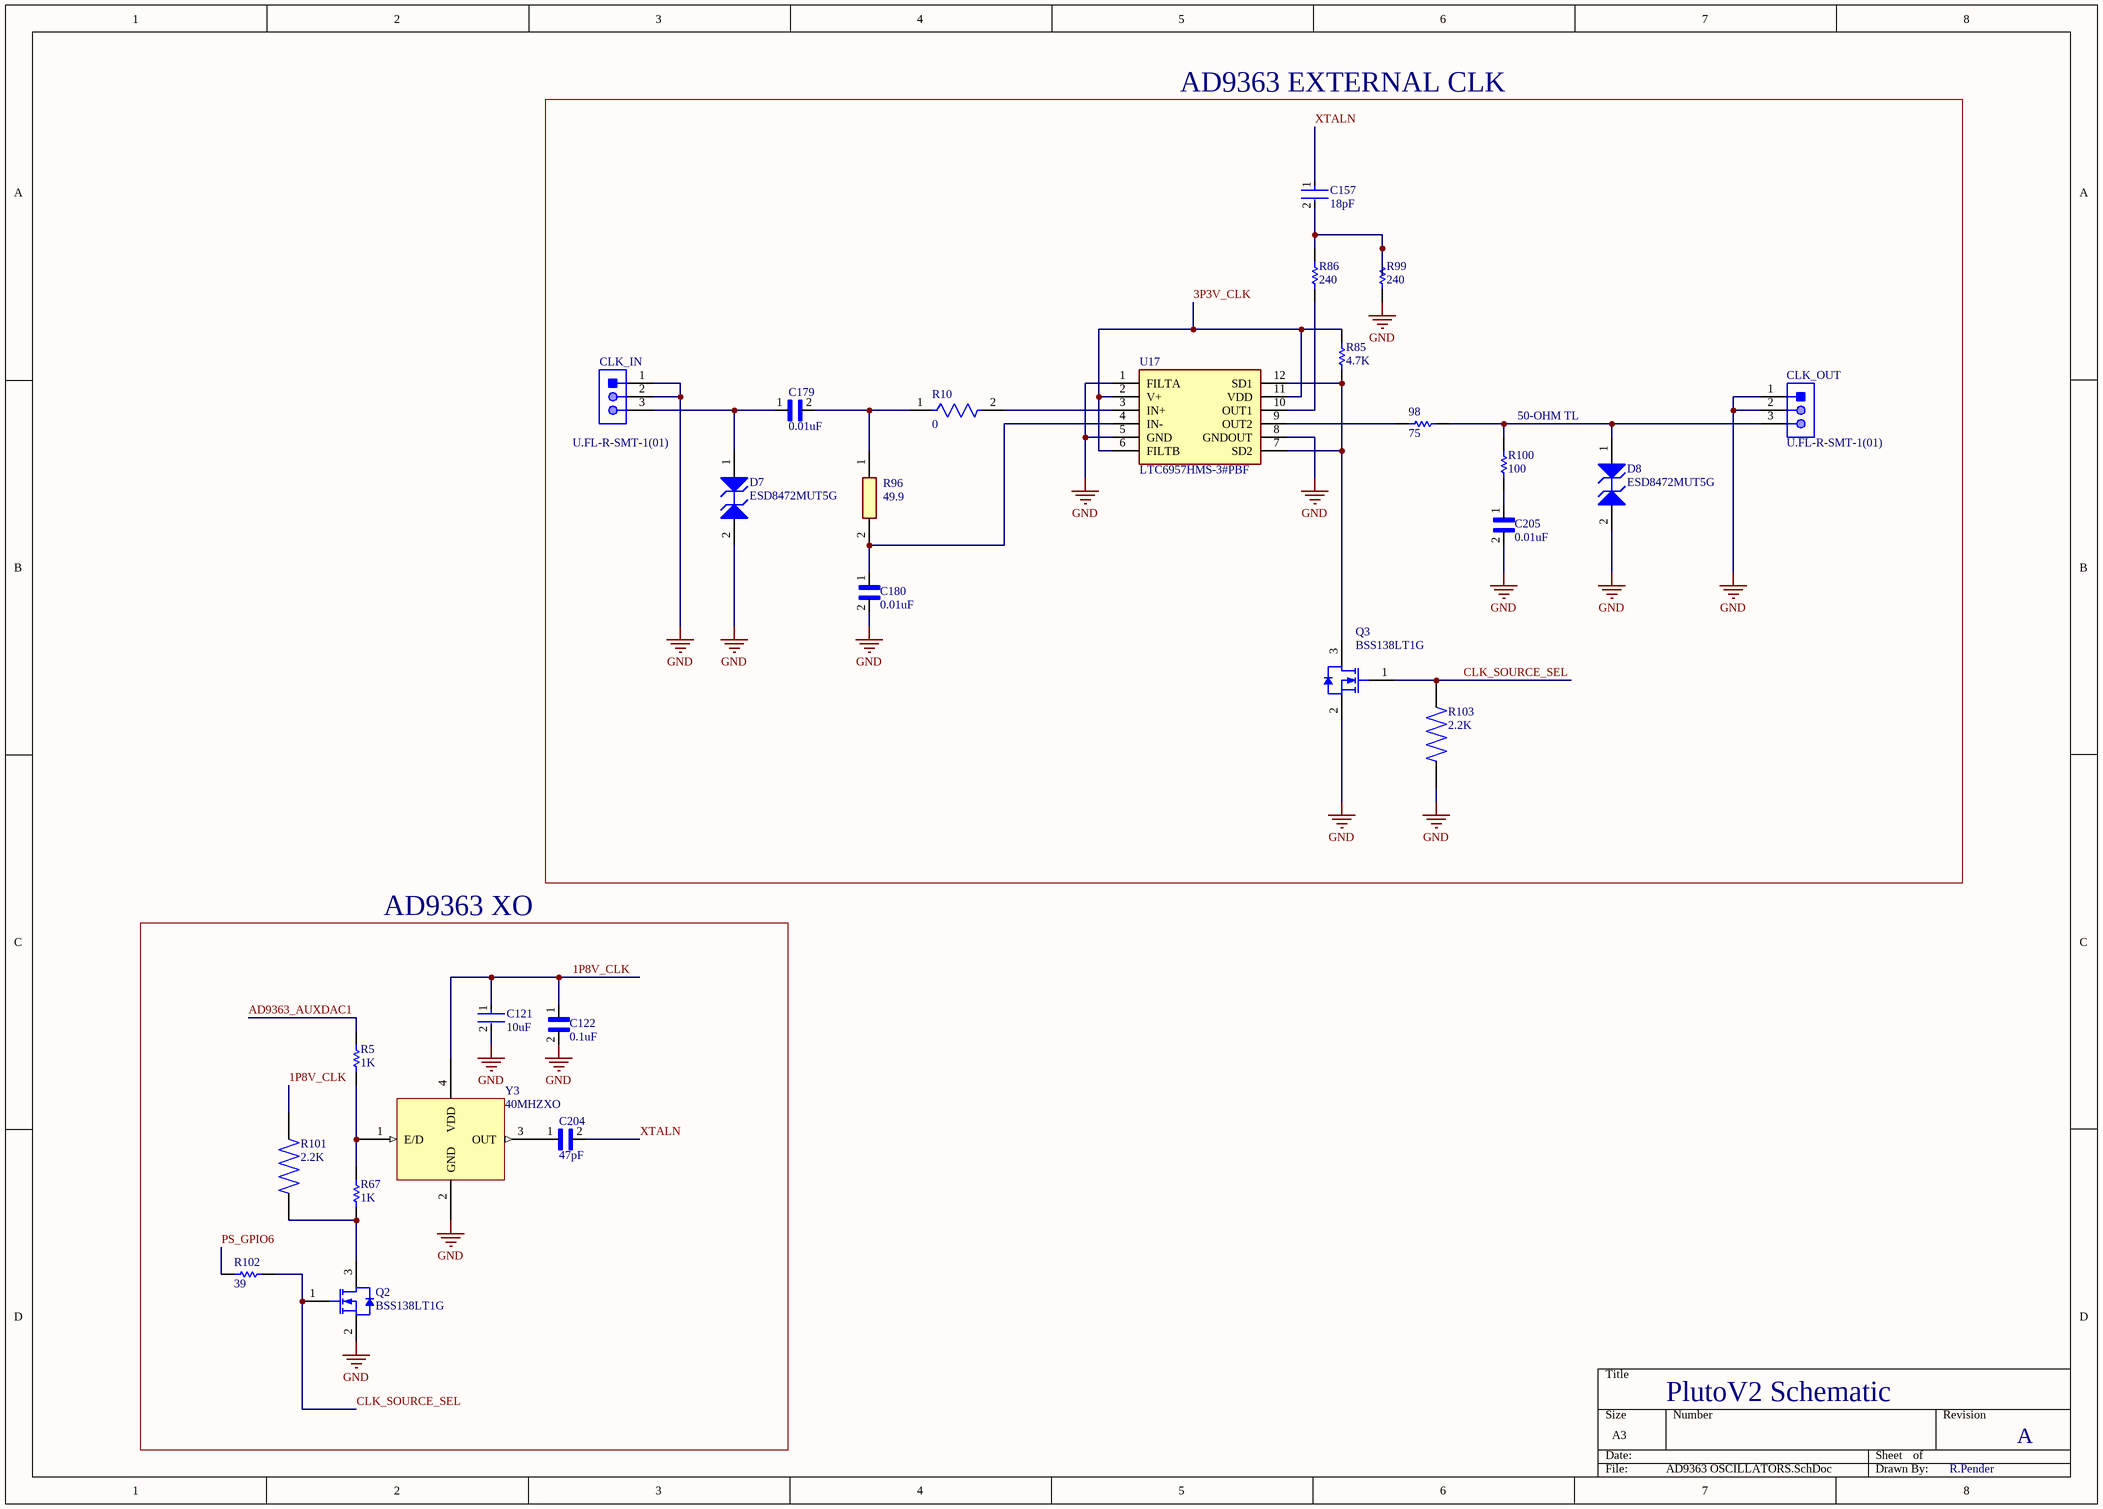
[diagram p13: AD9363 OSCILLATORS.SchDoc]

### Parts
98  75  [2-0402]
C121  10uF  [FP-GRM188-0_1-e0_2_0_55-IPC_C]
C122  0.1uF  [CAPC0603X33N]
C157  18pF  [FP-GRM033-0_03-IPC_A]
C179  0.01uF  [CAPC0603X33N]
C180  0.01uF  [CAPC0603X33N]
C204  47pF  [CAPC1005X55N]
C205  0.01uF  [CAPC0603X33N]
CLK_IN  U.FL-R-SMT-1(01)  [HRS-U.FL-R-SMT-3_V]
CLK_OUT  U.FL-R-SMT-1(01)  [HRS-U.FL-R-SMT-3_V]
D7  ESD8472MUT5G  [ONSC-X3DFN-2-152AF-01_V]
D8  ESD8472MUT5G  [ONSC-X3DFN-2-152AF-01_V]
Q2  BSS138LT1G  [ONSC-SOT-23-3-318-08_V]
Q3  BSS138LT1G  [ONSC-SOT-23-3-318-08_V]
R5  1K  [RESC0603X26X15NL03T05]
R10  0  [FP-ERJ1GN-IPC_A]
R67  1K  [2-0402]
R85  4.7K  [2-0402]
R86  240  [2-0402]
R96  49.9  [RESC1608X46N]
R99  240  [2-0402]
R100  100  [2-0402]
R101  2.2K  [RESC1005X35N]
R102  39  [2-0402]
R103  2.2K  [RESC1005X35N]
U17  LTC6957HMS-3#PBF  [SOP65P490X110-12N]
Y3  40MHZXO  [XO40MHz]

### Blocks framed on the sheet
AD9363 EXTERNAL CLK: 98 C157 C179 C180 C205 CLK_IN CLK_OUT D7 D8 Q3 R10 R85 R86 R96 R99 R100 R103 U17
AD9363 XO: C121 C122 C204 Q2 R5 R67 R101 R102 Y3

### Nets
GND: C121.2 C122.2 C180.2 C205.2 CLK_IN.1 CLK_IN.2 CLK_OUT.1 CLK_OUT.2 D7.2(A2) D8.2(A2) Q2.2(S) Q3.2(S) R99.1 R103.2 U17.1(FILTA) U17.5(GND) U17.8(GNDOUT) Y3.2(GND)
1P8V_CLK: C121.1 C122.1 R101.2 Y3.4(VDD)
3P3V_CLK: R85.2 U17.2(V+) U17.6(FILTB) U17.11(VDD)
AD9363_AUXDAC1: R5.1
CLK_SOURCE_SEL: Q2.1(G) Q3.1(G) R102.2 R103.1
PS_GPIO6: R102.1
XTALN: C157.1 C204.2
Net98_1: 98.1 U17.9(OUT2)
Net98_2: 98.2 CLK_OUT.3 D8.1(A1) R100.1
NetC157_2: C157.2 R86.2 R99.2
NetC179_1: C179.1 CLK_IN.3 D7.1(A1)
NetC179_2: C179.2 R10.1 R96.1
NetC180_1: C180.1 R96.2 U17.4(IN-)
NetC204_1: C204.1 Y3.3(OUT)
NetC205_1: C205.1 R100.2
NetQ2_3: Q2.3(D) R67.2 R101.1
NetQ3_3: Q3.3(D) R85.1 U17.7(SD2) U17.12(SD1)
NetR5_2: R5.2 R67.1 Y3.1(E/D)
NetR10_2: R10.2 U17.3(IN+)
NetR86_1: R86.1 U17.10(OUT1)

### Notes on the sheet
- (near R100) 50-OHM TL
- PlutoV2 Schematic
- A
- R.Pender

### Library data of the parts
98 R67 R85 R86 R99 R100 = ERJ2RK: as R2 on sheet POWERMANAGE; Published: 17-Dec-2003; LatestRevisionDate: 19-Mar-2004; LatestRevisionNote: Silkscreen size reduced.; PackageDocument: Mar-2003; PackageReference: 2-0402; Publisher: Altium Limited; Code_IPC: 1005 [0402]; ComponentLink1Description: Manufacturer Link; ComponentLink1URL: http://www.panasonic.com/industrial/components/resistive_products.htm; ComponentLink2Description: Datasheet; ComponentLink2URL: http://www.panasonic.com/industrial/components/pdf/AOA0000CE2.pdf
C121 = CMP-2006-02792-2: as C3 on sheet POWERMANAGE; Packaging: Tape and Reel; Voltage Rating (DC): 6.3V; Width: 0.031inch; Termination: SMD/SMT; Dielectric: X5R; Package Quantity: 4000; Voltage Rating: 6.3V; Capacitance: 10uF; Case/Package: 0603; Min Operating Temperature: -55°C; Voltage: 6.3V; Length: 1.6mm; Thickness: 0.035inch; Lead Free: Lead Free; Depth: 0.8mm; Case Code (Imperial): 0603; Max Operating Temperature: 85°C; Material: Ceramic; Height: 0.8mm; Tolerance: 20%; Mount: Surface Mount; REACH SVHC: No SVHC; Radiation Hardening: No; Case Code (Metric): 1608
C122 = GRM033R61C104ME84D: as C1 on sheet POWERMANAGE; Package: None; Price: None; Value: *; MP: GRM033R61C104ME84D; Availability: Unavailable
C157 = CMP-2010-01507-2: Chip Multilayer Ceramic Capacitors for General Purpose, 0201, 18pF, C0G, 30ppm/°C, 5%, 50V; Max Operating Temperature: 125°C; Case Code (Metric): 0603; Case Code (Imperial): 0201; Capacitance: 18pF; Voltage Rating (DC): 50V; Lead Free: Lead Free; Mount: Surface Mount; Radiation Hardening: No; Height: 0.3mm; Package Quantity: 15000; Depth: 0.3mm; Tolerance: 5%; Thickness: 0.013inch; Width: 0.3mm; Packaging: Tape and Reel; Voltage Rating: 50V; Dielectric: C0G; Length: 0.6mm; Termination: SMD/SMT; Min Operating Temperature: -55°C; Case/Package: 0201; Voltage: 50V
C179 C180 C205 = GRM033R71A103KA01D: as C2 on sheet POWERMANAGE; Package: 0603 Taiyo Yuden; MP: GRM033R71A103KA01D; Value: *; SnapEDA_Link: https://www.snapeda.com/parts/GRM033R71A103KA01D/Murata/view-part/4379446/?ref=snap; Availability: Unavailable; Price: None; Check_prices: https://www.snapeda.com/parts/GRM033R71A103KA01D/Murata/view-part/4379446/?ref=eda
C204 = GCM1555C1H470JA16D: 47pF Â±5% 50V Ceramic Capacitor C0G, NP0 0402 (1005 Metric); MF: Murata; Purchase-URL: https://pricing.snapeda.com/search/part/GCM1555C1H470JA16D/?ref=eda; Package: 1005 Taiyo Yuden; MP: GCM1555C1H470JA16D; Value: *; SnapEDA_Link: https://www.snapeda.com/parts/GCM1555C1H470JA16D/Murata+Electronics+North+America/view-part/?ref=snap; Digi-Key_Part_Number: 490-10670-2-ND; Check_prices: https://www.snapeda.com/parts/GCM1555C1H470JA16D/Murata+Electronics+North+America/view-part/?ref=eda
CLK_IN CLK_OUT = CMP-2000-05153-1: Ultra Small Coaxial Connector, 6 GHz, -40 to 90 degC, 3-Pin SMD, RoHS, Bulk; Manufacturer: Hirose Electric; Connector Style: U.FL; Impedance: 50Ohm; Dielectric Material: LiquidCrystalPolymer(LCP); Minimum Quantity: UltraMiniatureCoaxial; Online Catalog: U.FLSeries; Featured Product: HiroseU.FLSeries; Frequency - Max: 6GHz; Other Names: H122041 / U.FL-R-SMT-1(01)-ND; Contact Termination: Solder; Body Material: PhosphorBronze; Connector Type: Jack,MalePin; Body Finish: Silver; Center Contact Plating: Gold; Manufacturer URL: https://www.hirose.com; Family: CoaxialConnectors(RF); Fastening Type: Snap-On; Unit PriceUSD: U.FL; Series: U.FL; Package Reference: U.FL-R-SMT; Packaging: Bulk; Standard Package: 100; Mounting Type: SurfaceMount; Quantity Available: Bulk; Housing Color: Silver; Package Description: 3-Pin Surface Mount Device, Body 2.6 x 2.6 mm; Category: Connectors,Interconnects; Operating Temperature: -40degC~90degC; Center Contact Material: PhosphorBronze; Dynamic Catalog: U.FLSeries; Datasheet URL: https://datasheet.ciiva.com/26945/getdatasheetpartid-475239-26945414.pdf; Datasheet Version: Feb-09; Shield Termination: Solder
D7 D8 = CMP-1063-00281-1: Ultra-Low Capacitance ESD Protection, Micro-Packaged Diode for ESD Protection, 2-Pin X3DFN, Pb-Free, Tape and Reel; Manufacturer: On Semiconductor; IR Max (uA): 0.05; C Max (pF): 0.3; V(BR) Min (V): 7; VRWM Max (V): 5.3; Number of Lines: 1; Direction: Bidirectional; PartNumber: ESD8472MUT5G; PackageVersion: Rev. O, 04/2011; RoHS: Pb-Free; PackageDescription: 2-Pin Small Outline No-Lead, Body 0.62 x 0.32 mm, Pitch 0.355 mm; ComponentLink1Description: Manufacturer URL; ComponentLink1URL: http://www.onsemi.com/; Packing: Tape and Reel; Mounting Technology: Surface Mount; PackageReference: X3DFN-2-152AF-01; ComponentLink3Description: Package Specification; ComponentLink2Description: Datasheet; ComponentLink3URL: http://www.onsemi.cn/pub_link/Collateral/152AF.PDF; DatasheetVersion: Rev. 4; ComponentLink2URL: http://www.onsemi.cn/pub_link/Collateral/ESD8472-D.PDF
Q2 Q3 = CMP-1058-00767-1: Power MOSFET, 200 mA, 50 V, N-Channel, 3-Pin SOT-23, Pb-Free, Tape and Reel; Manufacturer: On Semiconductor; PD Max (W): 0.225; Coss Typ (pF): 12; V(BR)DSS Min (V): 50; VGS Max (V): 20; Channel Polarity: N Channel; Configuration: Single; VGS(th) Max (V): 1.5; Ciss Typ (pF): 40; Crss Typ (pF): 3.5; ID Max (A): 0.2; ComponentLink3Description: Package Specification; PackageDescription: 3-Pin Small Outline Transistor, Body 2.92 x 1.3 mm, Pitch 0.95 mm; PackageReference: SOT-23-3-318-08; RoHS: Pb-Free; Mounting Technology: Surface Mount; ComponentLink1Description: Manufacturer URL; ComponentLink2URL: http://www.onsemi.com/pub_link/Collateral/BSS138LT1-D.PDF; ComponentLink2Description: Datasheet; Packing: Tape and Reel; PackageVersion: Rev. AP, 11/2009; PartNumber: BSS138LT1G; Package Type: SOT-23-3; ComponentLink1URL: http://www.onsemi.com/; DatasheetVersion: Rev. 8; ComponentLink3URL: http://www.onsemi.cn/pub_link/Collateral/318-08.PDF
R5 = CMP-2004-03448-1: as R1 on sheet POWERMANAGE
R10 = CMP-1010-00001-3: RES SMD 0 OHM JUMPER 1/20W 0201; Temperature Coefficient: 600ppm/°C; Max Power Dissipation: 50mW; Resistance: 0R; Voltage Rating: 25V; Tolerance: 1%; Package Quantity: 15000; Case Code (Imperial): 0201; Number of Terminations: 2; Depth: 0.3mm; Lead Free: Lead Free; Military Standard: Not; Width: 0.3mm; Series: ERJ; Max Operating Temperature: 125°C; Construction: Rectangular; Contact Plating: Tin; RoHS Compliant: Yes; Height: 0.23mm; Voltage Rating (DC): 25V; Mount: Surface Mount; Min Operating Temperature: -55°C; Power Rating: 50mW; Features: Automotive AEC-Q200; Resistor Type: Thick Film; Case/Package: 0201; Case Code (Metric): 0603; Length: 0.6mm; Packaging: Tape and Reel
R96 = PCAN0603E49R9BST5: Resistor; Manufacturer_Name: Vishay; Datasheet Link: http://www.vishay.com/docs/60125/pcan.pdf; Height: 0.457mm; Manufacturer_Part_Number: PCAN0603E49R9BST5
R101 R103 = CRCW04022K20FKEDC: 2.2 kOhms Â±1% 0.063W, 1/16W Chip Resistor 0402 _1005 Metric_ Thick Film; MF: Vishay; Price: None; Package: 1005 Yageo; Availability: Unavailable; SnapEDA_Link: https://www.snapeda.com/parts/CRCW04022K20FKEDC/Vishay/view-part/4129871/?ref=snap; Value: *; MP: CRCW04022K20FKEDC
R102 = ERJ2GE: Thick Film Chip Resistor, 1 Ohm to 2.2M Ohm Range, 5% Tolerance, 0402 Size, 0.063 W; Note: If flow soldering, adjust pad width of PCB Footprint to 0.7 - 0.8 times the width of the resistor.; Published: 17-Dec-2003; LatestRevisionDate: 19-Mar-2004; LatestRevisionNote: Silkscreen size reduced.; PackageDocument: Mar-2003; PackageReference: 2-0402; Publisher: Altium Limited; Code_IPC: 1005 [0402]; ComponentLink1Description: Manufacturer Link; ComponentLink1URL: http://www.panasonic.com/industrial/components/resistive_products.htm; ComponentLink2Description: Datasheet; ComponentLink2URL: http://www.panasonic.com/industrial/components/pdf/AOA0000CE1.pdf
U17 = LTC6957HMS-3#PBF: Integrated Circuit; Manufacturer_Name: Analog Devices; Datasheet Link: https://componentsearchengine.com//LTC6957HMS-3#PBF.pdf; Height: 1.1mm; Mouser2 Part Number: 584-LTC6957HMS-3#PBF; Mouser2 Price/Stock: https://www.mouser.com/Search/Refine.aspx?Keyword=584-LTC6957HMS-3%23PBF; Manufacturer_Part_Number: LTC6957HMS-3#PBF

## Sheet RF Frontend 2.SchDoc
size A3; SheetNumber: 14; SheetTotal: 14
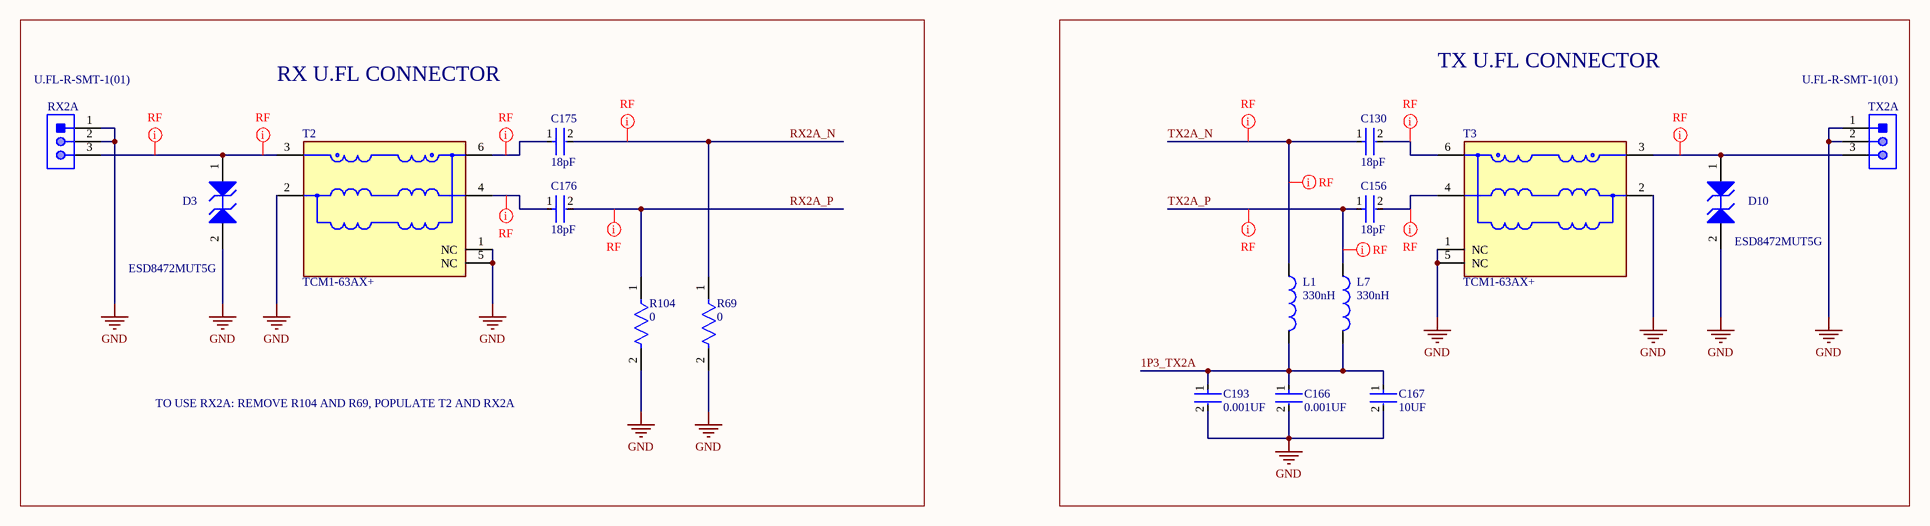
[diagram p14: RF Frontend 2.SchDoc]

### Parts
C130  18pF  [FP-GRM033-0_03-IPC_A]
C156  18pF  [FP-GRM033-0_03-IPC_A]
C166  0.001UF  [FP-GRM033-0_03-MFG]
C167  10UF  [FP-GRM188-0_1-e0_2_0_55-IPC_A]
C175  18pF  [FP-GRM033-0_03-IPC_A]
C176  18pF  [FP-GRM033-0_03-IPC_A]
C193  0.001UF  [FP-GRM033-0_03-MFG]
D3  ESD8472MUT5G  [ONSC-X3DFN-2-152AF-01_V]
D10  ESD8472MUT5G  [ONSC-X3DFN-2-152AF-01_V]
L1  330nH  [0402-A]
L7  330nH  [0402-A]
R69  0  [FP-ERJ1GN-IPC_A]
R104  0  [FP-ERJ1GN-IPC_A]
RX2A  U.FL-R-SMT-1(01)  [HRS-U.FL-R-SMT-3_V]
T2  TCM1-63AX+  [FP-TCM1-63AX+-MFG]
T3  TCM1-63AX+  [FP-TCM1-63AX+-MFG]
TX2A  U.FL-R-SMT-1(01)  [HRS-U.FL-R-SMT-3_V]

### Blocks framed on the sheet
RX U.FL CONNECTOR: C175 C176 D3 R69 R104 RX2A T2
TX U.FL CONNECTOR: C130 C156 C166 C167 C193 D10 L1 L7 T3 TX2A

### Nets
GND: C166.2 C167.2 C193.2 D3.2(A2) D10.2(A2) R69.2 R104.2 RX2A.1 RX2A.2 T2.1(NC) T2.2(GND) T2.5(NC) T3.1(NC) T3.2(GND) T3.5(NC) TX2A.1 TX2A.2
1P3_TX2A: C166.1 C167.1 C193.1 L1.2 L7.2  [project net 1P3_SUPPLY_B]
RX2A_N: C175.2 R69.1
RX2A_P: C176.2 R104.1
TX2A_N: C130.1 L1.1
TX2A_P: C156.1 L7.1
NetC130_2: C130.2 T3.6(SECONDARY_DOT)
NetC156_2: C156.2 T3.4(SECONDARY)
NetC175_1: C175.1 T2.6(SECONDARY_DOT)
NetC176_1: C176.1 T2.4(SECONDARY)
NetD3_1: D3.1(A1) RX2A.3 T2.3(PRIMARY_DOT)
NetD10_1: D10.1(A1) T3.3(PRIMARY_DOT) TX2A.3

### Layout directives
net class RF: NetC130_2, NetC156_2, NetC175_1, NetC176_1, NetD3_1, NetD10_1, RX2A_N, RX2A_P, TX2A_N, TX2A_P

### Notes on the sheet
- TO USE RX2A: REMOVE R104 AND R69, POPULATE T2 AND RX2A

### Library data of the parts
C130 C156 C175 C176 = CMP-2010-01507-2: as C157 on sheet AD9363 OSCILLATORS; Max Operating Temperature: 125°C; Case Code (Metric): 0603; Case Code (Imperial): 0201; Capacitance: 18pF; Voltage Rating (DC): 50V; Lead Free: Lead Free; Mount: Surface Mount; Radiation Hardening: No; Height: 0.3mm; Package Quantity: 15000; Depth: 0.3mm; Tolerance: 5%; Thickness: 0.013inch; Width: 0.3mm; Packaging: Tape and Reel; Voltage Rating: 50V; Dielectric: C0G; Length: 0.6mm; Termination: SMD/SMT; Min Operating Temperature: -55°C; Case/Package: 0201; Voltage: 50V
C166 C193 = CMP-2010-01706-2: Chip Multilayer Ceramic Capacitors for General Purpose, 0201, 1000pF, X7R, 15%, 10%, 25V; Capacitance: 1nF; Max Operating Temperature: 125°C; Material: Ceramic; Lead Free: Lead Free; Radiation Hardening: No; Dielectric: X7R; Height: 0.3mm; Mount: Surface Mount; Packaging: Tape and Reel; Termination: SMD/SMT; Thickness: 0.013inch; Case Code (Metric): 0603; Tolerance: 10%; Voltage Rating (DC): 25V; REACH SVHC: No SVHC; Package Quantity: 1; Depth: 0.3mm; Voltage: 25V; Case/Package: 0201; Case Code (Imperial): 0201; Voltage Rating: 25V; Min Operating Temperature: -55°C; Length: 0.6mm; Width: 0.012inch
C167 = CMP-2006-02792-2: as C3 on sheet POWERMANAGE; Packaging: Tape and Reel; Voltage Rating (DC): 6.3V; Width: 0.031inch; Termination: SMD/SMT; Dielectric: X5R; Package Quantity: 4000; Voltage Rating: 6.3V; Capacitance: 10uF; Case/Package: 0603; Min Operating Temperature: -55°C; Voltage: 6.3V; Length: 1.6mm; Thickness: 0.035inch; Lead Free: Lead Free; Depth: 0.8mm; Case Code (Imperial): 0603; Max Operating Temperature: 85°C; Material: Ceramic; Height: 0.8mm; Tolerance: 20%; Mount: Surface Mount; REACH SVHC: No SVHC; Radiation Hardening: No; Case Code (Metric): 1608
D3 D10 = CMP-1063-00281-1: as D7 on sheet AD9363 OSCILLATORS; PartNumber: ESD8472MUT5G; PackageVersion: Rev. O, 04/2011; RoHS: Pb-Free; PackageDescription: 2-Pin Small Outline No-Lead, Body 0.62 x 0.32 mm, Pitch 0.355 mm; ComponentLink1Description: Manufacturer URL; ComponentLink1URL: http://www.onsemi.com/; Packing: Tape and Reel; Mounting Technology: Surface Mount; PackageReference: X3DFN-2-152AF-01; ComponentLink3Description: Package Specification; ComponentLink2Description: Datasheet; ComponentLink3URL: http://www.onsemi.cn/pub_link/Collateral/152AF.PDF; DatasheetVersion: Rev. 4; ComponentLink2URL: http://www.onsemi.cn/pub_link/Collateral/ESD8472-D.PDF
L1 L7 = Inductor: Code_IEC: 1005; Value: 10mH; Published: 8-Jun-2000; LatestRevisionDate: 29-May-2009; LatestRevisionNote: IPC-7351 Footprint Added.; PackageReference: 0402-A; Publisher: Altium Limited; PackageDescription: Chip Inductor; Code_JEITA: 0402
R69 R104 = CMP-1010-00001-3: as R10 on sheet AD9363 OSCILLATORS; Package Quantity: 15000; Case Code (Imperial): 0201; Number of Terminations: 2; Depth: 0.3mm; Lead Free: Lead Free; Military Standard: Not; Width: 0.3mm; Series: ERJ; Max Operating Temperature: 125°C; Construction: Rectangular; Contact Plating: Tin; RoHS Compliant: Yes; Height: 0.23mm; Voltage Rating (DC): 25V; Mount: Surface Mount; Min Operating Temperature: -55°C; Power Rating: 50mW; Features: Automotive AEC-Q200; Resistor Type: Thick Film; Case/Package: 0201; Case Code (Metric): 0603; Length: 0.6mm; Packaging: Tape and Reel
RX2A TX2A = CMP-2000-05153-1: as CLK_IN on sheet AD9363 OSCILLATORS; Manufacturer URL: https://www.hirose.com; Family: CoaxialConnectors(RF); Fastening Type: Snap-On; Unit PriceUSD: U.FL; Series: U.FL; Package Reference: U.FL-R-SMT; Packaging: Bulk; Standard Package: 100; Mounting Type: SurfaceMount; Quantity Available: Bulk; Housing Color: Silver; Package Description: 3-Pin Surface Mount Device, Body 2.6 x 2.6 mm; Category: Connectors,Interconnects; Operating Temperature: -40degC~90degC; Center Contact Material: PhosphorBronze; Dynamic Catalog: U.FLSeries; Datasheet URL: https://datasheet.ciiva.com/26945/getdatasheetpartid-475239-26945414.pdf; Datasheet Version: Feb-09; Shield Termination: Solder
T2 T3 = CMP-199822-000001-1: 1:1 CORE & WIRE Transformer, 10 - 6000 MHz, 50Ω; Manufacturer: Mini-Circuits; Insertion Loss: 1.16-1.8dB; Return Loss: 9.42-16.9dB; Lead Free: Yes; Device Class L3: unset; Temperature: -40°C to +85°C; Manufacturer Part Number: TCM1-63AX+; Frequency: 10-6000MHz; Device Class L2: Transformers; RoHS: TRUE; Octopart: https://octopart.com/tcm1-63ax%2B-mini-circuits-107315723; Temperature Range Low: -40°C; Category: Trans; Package: 0; ComponentLink2URL: https://www.minicircuits.com/pdfs/TCM1-63AX+.pdf; ComponentLink2Description: Datasheet; Automotive: No; Height: 4.06mm; Device Class L1: Passive Components; Temperature Range High: +85°C; Turns Ratio: 1:1

## Nets that join several sheets
GND: USB (28 pins), DDR3 (48 pins), ZYNQ JTAG and Decoupling (70 pins), ZYNQ 34_35 and QPSI (23 pins), AD9363 (56 pins), RF FRONTEND (31 pins), CONNECTORS_SELECTORS (22 pins), POWERREG (29 pins), POWERMANAGE (57 pins), POWERMANAGE2 (15 pins), TESTPOINTS (8 pins), AD9363 OSCILLATORS (18 pins), RF Frontend 2 (17 pins)
PGND: CONNECTORS_SELECTORS (5 pins), TESTPOINTS (PGND.1)
1P3_SUPPLY_A: AD9363 (6 pins), POWERMANAGE (18 pins), TESTPOINTS (1P3V_A.1)
1P3_SUPPLY_B: AD9363 (7 pins), RF FRONTEND (5 pins), POWERMANAGE (20 pins), TESTPOINTS (1P3V_B.1), RF Frontend 2 (5 pins)
1P8V_CLK: POWERMANAGE2 (C170.1 U12.1), TESTPOINTS (1P8V_CLK.1), AD9363 OSCILLATORS (C121.1 C122.1 R101.2 Y3.4)
1v8: USB (24 pins), DDR3 (C82.1 C83.1 R44.1), ZYNQ JTAG and Decoupling (38 pins), ZYNQ 34_35 and QPSI (23 pins), CONNECTORS_SELECTORS (P1.10), POWERREG (6 pins), POWERMANAGE (15 pins), TESTPOINTS (1V8.1 1V8_2.1)
1v35: DDR3 (31 pins), ZYNQ JTAG and Decoupling (14 pins), POWERREG (5 pins), TESTPOINTS (1V35.1)
3P3V: AD9363 (U5.B8), POWERMANAGE2 (5 pins), TESTPOINTS (VDD_GPO.1)
3P3V_CLK: POWERMANAGE2 (C200.1 C201.1 C202.1 E8.2), AD9363 OSCILLATORS (R85.2 U17.2 U17.6 U17.11)
AD9363_AUXADC: AD9363 (C207.1 U5.L5), TESTPOINTS (ADC.1)
AD9363_AUXDAC1: AD9363 (C206.1 U5.B3), TESTPOINTS (DAC1.1), AD9363 OSCILLATORS (R5.1)
AD9363_AUXDAC2: AD9363 (C208.1 U5.C3), TESTPOINTS (DAC2.1)
AD9363_GPO_0: AD9363 (U5.B7), TESTPOINTS (GPO0.1)
AD9363_GPO_1: AD9363 (U5.B6), TESTPOINTS (GPO1.1)
AD9363_GPO_2: AD9363 (U5.B5), TESTPOINTS (GPO2.1)
AD9363_GPO_3: AD9363 (U5.B4), TESTPOINTS (GPO3.1)
CTRL_IN0: ZYNQ 34_35 and QPSI (U4.F13), AD9363 (U5.C5)
CTRL_IN1: ZYNQ 34_35 and QPSI (U4.F14), AD9363 (U5.C6)
CTRL_IN2: ZYNQ 34_35 and QPSI (U4.G15), AD9363 (U5.D6)
CTRL_IN3: ZYNQ 34_35 and QPSI (U4.F15), AD9363 (U5.D5)
IO_02_34_AD9361_CLKOUT: ZYNQ 34_35 and QPSI (U4.P8), AD9363 (U5.J6)
IO_02_34_AD9361_RST: ZYNQ 34_35 and QPSI (U4.P9), AD9363 (U5.K5)
IO_L01_34_FB_CLK: ZYNQ 34_35 and QPSI (U4.P10), AD9363 (U5.F10)
IO_L01_34_RX_D0: ZYNQ 34_35 and QPSI (U4.H14), AD9363 (U5.K11)
IO_L01_34_RX_D1: ZYNQ 34_35 and QPSI (U4.J13), AD9363 (U5.J12)
IO_L02_34_RX_D2: ZYNQ 34_35 and QPSI (U4.G14), AD9363 (U5.K10)
IO_L02_34_RX_D3: ZYNQ 34_35 and QPSI (U4.H13), AD9363 (U5.J11)
IO_L03_34_RX_D4: ZYNQ 34_35 and QPSI (U4.G12), AD9363 (U5.K9)
IO_L03_34_RX_D5: ZYNQ 34_35 and QPSI (U4.H12), AD9363 (U5.J10)
IO_L04_34_RX_D6: ZYNQ 34_35 and QPSI (U4.G11), AD9363 (U5.K8)
IO_L04_34_RX_D7: ZYNQ 34_35 and QPSI (U4.J14), AD9363 (U5.J9)
IO_L05_34_RX_D8: ZYNQ 34_35 and QPSI (U4.J15), AD9363 (U5.K7)
IO_L05_34_RX_D9: ZYNQ 34_35 and QPSI (U4.K15), AD9363 (U5.J8)
IO_L06_34_RX_D10: ZYNQ 34_35 and QPSI (U4.H11), AD9363 (U5.J7)
IO_L06_34_RX_D11: ZYNQ 34_35 and QPSI (U4.J11), AD9363 (U5.H8)
IO_L07_34_RX_FRAME: ZYNQ 34_35 and QPSI (U4.N13), AD9363 (U5.G8)
IO_L08_34_CTRL_OUT0: ZYNQ 34_35 and QPSI (U4.L15), AD9363 (U5.D4)
IO_L08_34_CTRL_OUT1: ZYNQ 34_35 and QPSI (U4.M15), AD9363 (U5.E4)
IO_L09_34_TX_FRAME: ZYNQ 34_35 and QPSI (U4.L14), AD9363 (U5.G9)
IO_L10_34_EN_AGC: ZYNQ 34_35 and QPSI (U4.L13), AD9363 (U5.G5)
IO_L11_34_ENABLE: ZYNQ 34_35 and QPSI (U4.K12), AD9363 (U5.G6)
IO_L11_34_TXNRX: ZYNQ 34_35 and QPSI (U4.K11), AD9363 (U5.H4)
IO_L12_MRCC_34_DATA_CLK: ZYNQ 34_35 and QPSI (U4.L12), AD9363 (U5.G11)
IO_L13_34_CTRL_OUT2: ZYNQ 34_35 and QPSI (U4.N11), AD9363 (U5.E5)
IO_L13_34_CTRL_OUT3: ZYNQ 34_35 and QPSI (U4.N12), AD9363 (U5.E6)
IO_L15_34_TX_D0: ZYNQ 34_35 and QPSI (U4.P15), AD9363 (U5.E12)
IO_L15_34_TX_D1: ZYNQ 34_35 and QPSI (U4.R13), AD9363 (U5.D11)
IO_L16_34_TX_D2: ZYNQ 34_35 and QPSI (U4.R15), AD9363 (U5.E11)
IO_L16_34_TX_D3: ZYNQ 34_35 and QPSI (U4.P11), AD9363 (U5.D10)
IO_L17_34_TX_D4: ZYNQ 34_35 and QPSI (U4.R11), AD9363 (U5.E10)
IO_L17_34_TX_D5: ZYNQ 34_35 and QPSI (U4.R12), AD9363 (U5.D9)
IO_L18_34_TX_D6: ZYNQ 34_35 and QPSI (U4.P14), AD9363 (U5.E9)
IO_L18_34_TX_D7: ZYNQ 34_35 and QPSI (U4.P13), AD9363 (U5.D8)
IO_L19_34_TX_D8: ZYNQ 34_35 and QPSI (U4.N9), AD9363 (U5.E8)
IO_L19_34_TX_D9: ZYNQ 34_35 and QPSI (U4.M9), AD9363 (U5.D7)
IO_L20_34_TX_D10: ZYNQ 34_35 and QPSI (U4.R8), AD9363 (U5.F8)
IO_L20_34_TX_D11: ZYNQ 34_35 and QPSI (U4.R7), AD9363 (U5.E7)
IO_L21_34_CTRL_OUT4: ZYNQ 34_35 and QPSI (U4.M10), AD9363 (U5.F6)
IO_L21_34_CTRL_OUT5: ZYNQ 34_35 and QPSI (U4.M11), AD9363 (U5.F5)
IO_L22_34_CTRL_OUT6: ZYNQ 34_35 and QPSI (U4.N7), AD9363 (U5.F4)
IO_L22_34_CTRL_OUT7: ZYNQ 34_35 and QPSI (U4.N8), AD9363 (U5.G4)
IO_L23_35_SPI_CLK: ZYNQ 34_35 and QPSI (U4.E11), AD9363 (U5.J4)
IO_L23_35_SPI_ENB: ZYNQ 34_35 and QPSI (U4.E12), AD9363 (U5.K6)
IO_L24_35_SPI_DI: ZYNQ 34_35 and QPSI (U4.E13), AD9363 (U5.J5)
IO_L24_35_SPI_DO: ZYNQ 34_35 and QPSI (U4.F12), AD9363 (U5.L6)
JTAG_TCK: ZYNQ JTAG and Decoupling (U4.G9), CONNECTORS_SELECTORS (P1.4), TESTPOINTS (TCK.1)
JTAG_TDI: ZYNQ JTAG and Decoupling (U4.L7), CONNECTORS_SELECTORS (P1.8), TESTPOINTS (TDI.1)
JTAG_TDO: ZYNQ JTAG and Decoupling (U4.L8), CONNECTORS_SELECTORS (P1.6), TESTPOINTS (TDO.1)
JTAG_TMS: ZYNQ JTAG and Decoupling (U4.L9), CONNECTORS_SELECTORS (P1.2), TESTPOINTS (TMS.1)
PG_1P3V: USB (R13.2), POWERMANAGE (U1.5 U7.5), POWERMANAGE2 (U11.4 U12.4), TESTPOINTS (PG_1P3V.1)
PG_1P35V: POWERREG (R50.1 U6.12), POWERMANAGE (U1.4 U7.4)
PL_GPIO0: ZYNQ 34_35 and QPSI (U4.K13), TESTPOINTS (L10P.1)
PL_GPIO1: ZYNQ 34_35 and QPSI (U4.M12), TESTPOINTS (L12N.1)
PL_GPIO2: ZYNQ 34_35 and QPSI (U4.R10), TESTPOINTS (L24N.1)
PL_GPIO3: ZYNQ 34_35 and QPSI (R97.1 U4.N14), TESTPOINTS (L7N.1)
PL_GPIO4: ZYNQ 34_35 and QPSI (R68.1 U4.M14), TESTPOINTS (L9N.1)
PS-SRST#: USB (R74.1 U4.B11), ZYNQ 34_35 and QPSI (U13.A4)
PS_GPIO0: USB (U4.D8), TESTPOINTS (MIO0.1)
PS_GPIO1: USB (U4.B10), TESTPOINTS (MIO10.1)
PS_GPIO2: USB (U4.D6), TESTPOINTS (MIO11.1)
PS_GPIO3: USB (U4.B5), TESTPOINTS (MIO09.1)
PS_GPIO4: USB (U4.C13), TESTPOINTS (MIO53.1)
PS_GPIO5: USB (U4.D13), TESTPOINTS (MIO49.1)
PS_GPIO6: USB (U4.B12), TESTPOINTS (MIO48.1), AD9363 OSCILLATORS (R102.1)
PS_MIO01_500_QSPI0_SS_B: USB (U4.A5), ZYNQ 34_35 and QPSI (R14.2 U13.C2)
PS_MIO02_500_QSPI0_IO0: USB (U4.A8), ZYNQ 34_35 and QPSI (R120.1 U13.D3)
PS_MIO03_500_QSPI0_IO1: USB (U4.A7), ZYNQ 34_35 and QPSI (R119.1 U13.D2)
PS_MIO04_500_QSPI0_IO2: USB (U4.C8), ZYNQ 34_35 and QPSI (R121.1 U13.C4)
PS_MIO05_500_QSPI0_IO3: USB (U4.A9), ZYNQ 34_35 and QPSI (R122.1 U13.D4), CONNECTORS_SELECTORS (P1.5), TESTPOINTS (JTAG_BOOT.1)
PS_MIO06_500_QSPI0_SCLK: USB (U4.A10), ZYNQ 34_35 and QPSI (R116.1 U13.B2)
PWR_CLK: POWERREG (R89.2 R90.1), POWERMANAGE (U3.1)
RX1A_N: AD9363 (U5.M2), RF FRONTEND (C133.2)
RX1A_P: AD9363 (U5.M1), RF FRONTEND (C134.2)
RX2A_N: AD9363 (U5.A1), RF Frontend 2 (C175.2 R69.1)
RX2A_P: AD9363 (U5.A2), RF Frontend 2 (C176.2 R104.1)
TX1A_N: AD9363 (U5.M8), RF FRONTEND (C131.1 L8.1)
TX1A_P: AD9363 (U5.M7), RF FRONTEND (C132.1 L9.1)
TX2A_N: AD9363 (U5.A7), RF Frontend 2 (C130.1 L1.1)
TX2A_P: AD9363 (U5.A8), RF Frontend 2 (C156.1 L7.1)
UART_RX: USB (R95.2 U4.C6), CONNECTORS_SELECTORS (P1.1), TESTPOINTS (RX.1)
UART_TX: USB (U4.B7 U9.2), CONNECTORS_SELECTORS (P1.3), TESTPOINTS (TX.1)
USB_ID: USB (U15.23), CONNECTORS_SELECTORS (D1.3 P2.4)
USB_OTG_CPEN: USB (U15.17), CONNECTORS_SELECTORS (U16.B1)
USB_OTG_N: USB (U15.19), CONNECTORS_SELECTORS (L6.4)
USB_OTG_P: USB (U15.18), CONNECTORS_SELECTORS (L6.1)
USB_UART_N: USB (C196.1 R79.2), CONNECTORS_SELECTORS (D2.6 P3.2)
USB_UART_P: USB (C197.1 R81.1), CONNECTORS_SELECTORS (D2.1 P3.3)
USB_VBUS_OTG: USB (U15.22), CONNECTORS_SELECTORS (R88.2)
USR_LED: USB (U4.D10), ZYNQ JTAG and Decoupling (Q4.1 R75.1)
VCCPINT: ZYNQ JTAG and Decoupling (17 pins), POWERMANAGE (6 pins), TESTPOINTS (1P0V.1)
VDD_INTERFACE: AD9363 (U5.H12), POWERMANAGE (7 pins)
VIN: USB (5 pins), DDR3 (C62.1 R221.1 R222.1 U14.10), ZYNQ JTAG and Decoupling (DS1.1 DS2.1), CONNECTORS_SELECTORS (C184.1 C185.1 U8.9-10 U8.15-16), POWERREG (13 pins), POWERMANAGE (C8.1 C9.1 C11.1 R1.2), POWERMANAGE2 (C123.1 C169.1 E2.1 E7.1)
VIN_5V_USB_POWER: USB (R80.1), CONNECTORS_SELECTORS (7 pins)
VTTVREF: DDR3 (7 pins), ZYNQ JTAG and Decoupling (U4.F4)
XTALN: AD9363 (U5.M12), AD9363 OSCILLATORS (C157.1 C204.2)